# Altium project SGK_DVR_01.PrjPcb (part 2 of 2)

## Sheet P06 CPU_2.SchDoc
size 386 x 246 mm
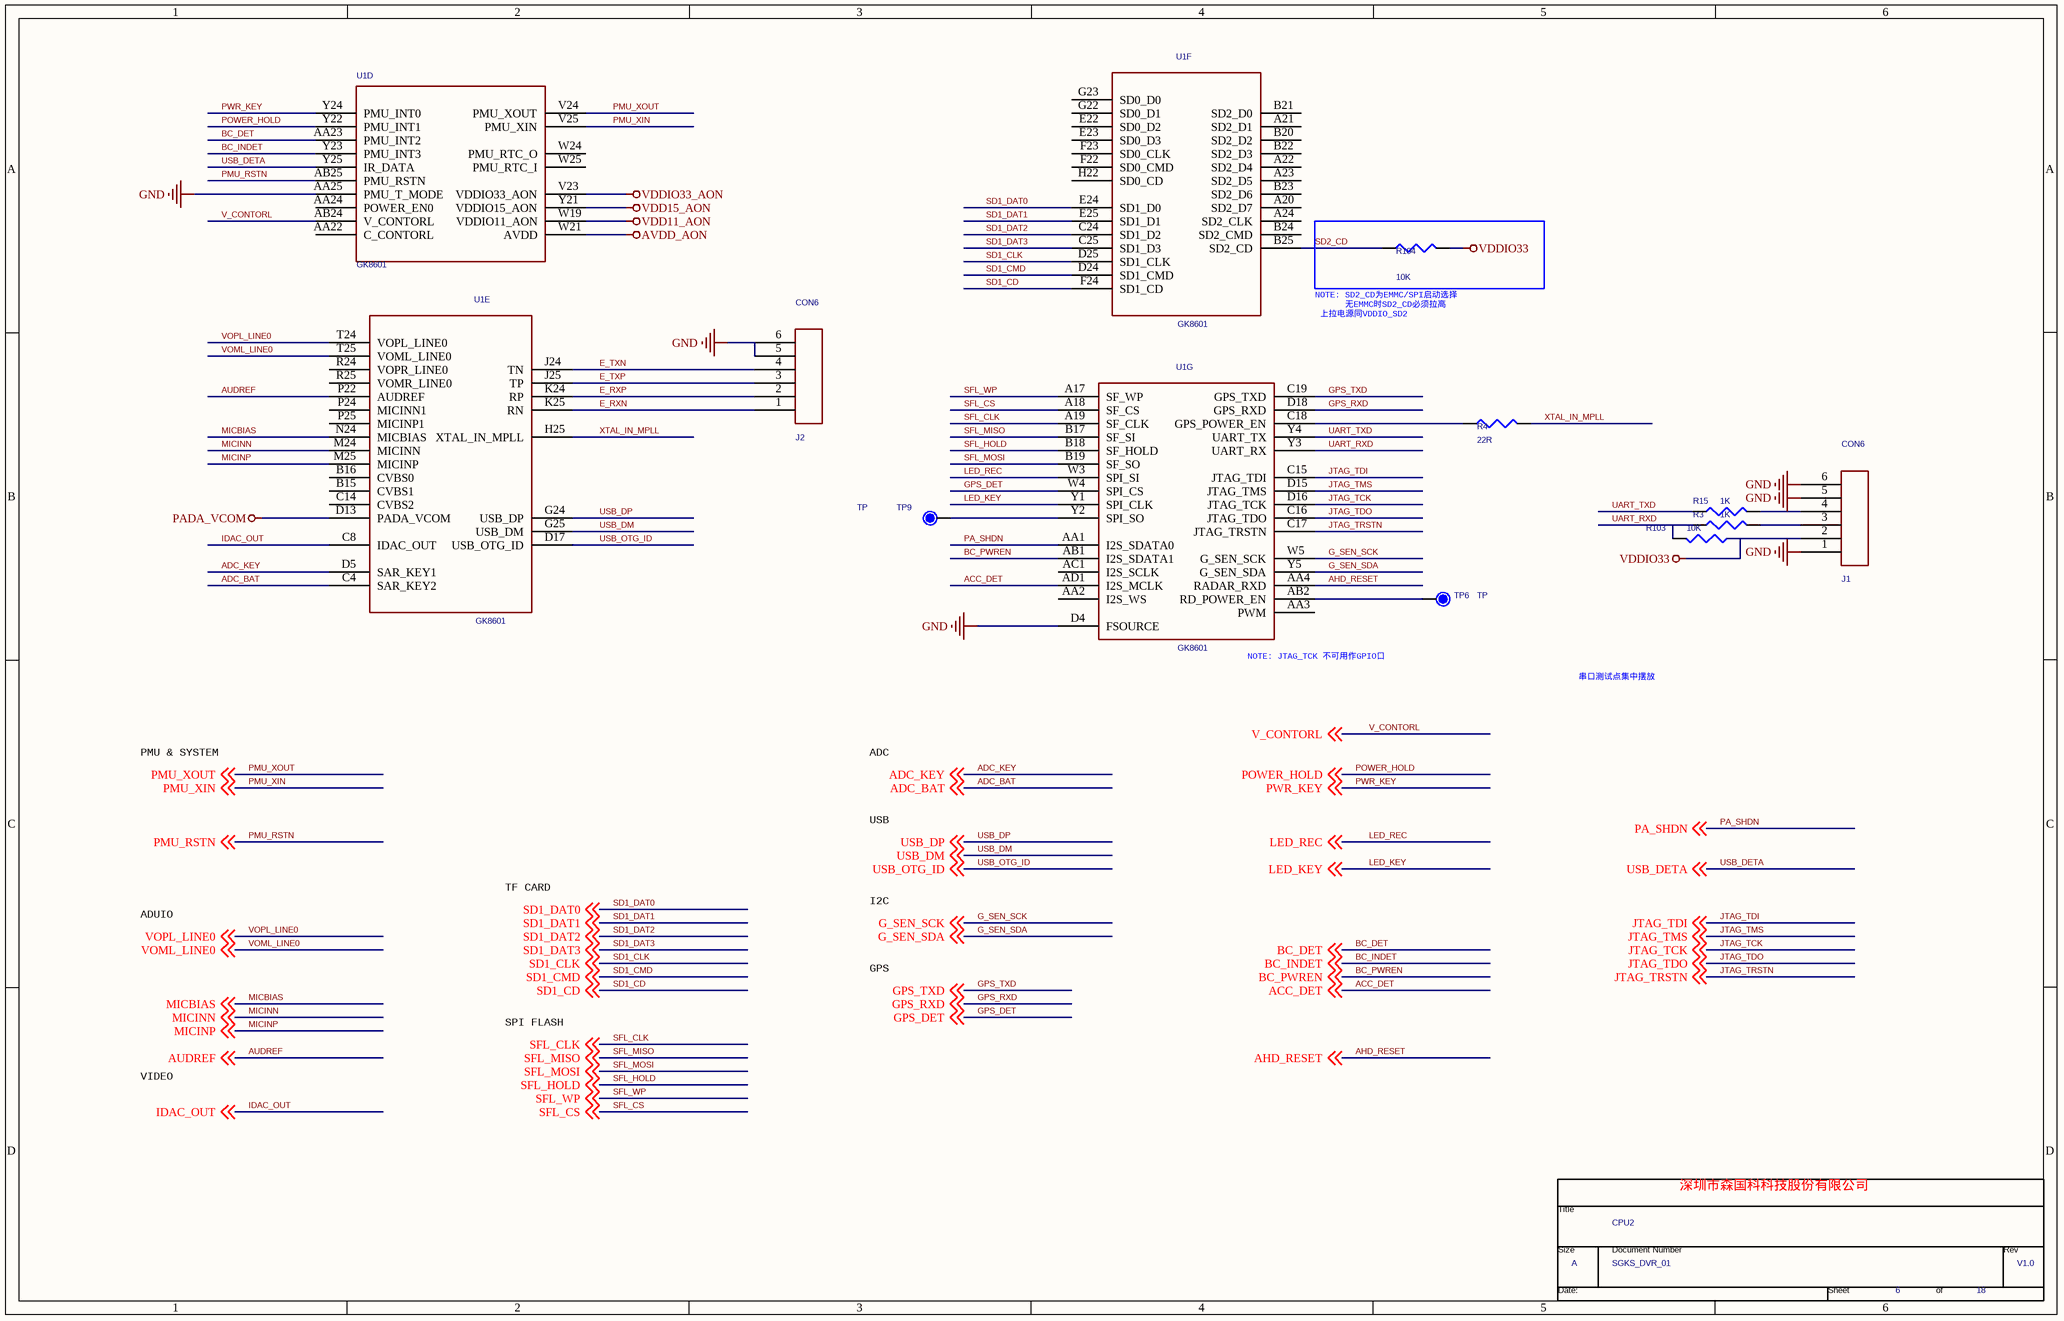
[diagram p11: P06 CPU_2.SchDoc]

### Parts
(Parts that share a designator on the sheet are numbered #1, #2 ... from top to bottom, then left to right.)
*#12  Page Count: 18  Page Number: 6  Page Size: A  Title: CPU2  RevCode: V1.0  Doc: SGKS_DVR_01  (hidden comment: TitleBlock0)  (graphical)
J1  CON6  [SM_125X4_180]
J2  CON6  [SM_125X4_180]
R3  1K  [R0603/SMD]
R4  22R  [R0603/SMD]
R15  1K  [R0603/SMD]
R103  10K  [R0402]
R104  10K  [R0603/SMD]
TP6  TP  [TP/SMD/D1.0]
TP9  TP  [TP/SMD/D1.0]
U1  GK8601  [FBGA-569-0.65-17X17]  (parts D,E,F,G of 12)

### Nets
AVDD_AON: J1.2 R103.1 R104.1 U1.V23(VDDIO33_AON) U1.W21(AVDD)  [also labelled VDDIO33, VDDIO33_AON]  [project net AVDD33]
GND: J1.1 J1.5 J1.6 J2.5 J2.6 U1.AA25(PMU_T_MODE) U1.D4(FSOURCE)
PADA_VCOM: U1.D13(PADA_VCOM)
VDD11_AON: U1.W19(VDDIO11_AON)  [project net VDD11]
VDD15_AON: U1.Y21(VDDIO15_AON)  [project net VDD15]
ACC_DET: U1.AD1(I2S_MCLK) ; off-sheet ACC_DET
ADC_BAT: U1.C4(SAR_KEY2) ; off-sheet ADC_BAT
ADC_KEY: U1.D5(SAR_KEY1) ; off-sheet ADC_KEY
AHD_RESET: U1.AA4(RADAR_RXD) ; off-sheet AHD_RESET
AUDREF: U1.P22(AUDREF) ; off-sheet AUDREF
BC_DET: U1.AA23(PMU_INT2) ; off-sheet BC_DET
BC_INDET: U1.Y23(PMU_INT3) ; off-sheet BC_INDET
BC_PWREN: U1.AB1(I2S_SDATA1) ; off-sheet BC_PWREN
E_RXN: J2.1 U1.K25(RN)
E_RXP: J2.2 U1.K24(RP)
E_TXN: J2.4 U1.J24(TN)
E_TXP: J2.3 U1.J25(TP)
G_SEN_SCK: U1.W5(G_SEN_SCK) ; off-sheet G_SEN_SCK
G_SEN_SDA: U1.Y5(G_SEN_SDA) ; off-sheet G_SEN_SDA
GPS_DET: U1.W4(SPI_CS) ; off-sheet GPS_DET
GPS_RXD: U1.D18(GPS_RXD) ; off-sheet GPS_RXD
GPS_TXD: U1.C19(GPS_TXD) ; off-sheet GPS_TXD
IDAC_OUT: U1.C8(IDAC_OUT) ; off-sheet IDAC_OUT
JTAG_TCK: U1.D16(JTAG_TCK) ; off-sheet JTAG_TCK
JTAG_TDI: U1.C15(JTAG_TDI) ; off-sheet JTAG_TDI
JTAG_TDO: U1.C16(JTAG_TDO) ; off-sheet JTAG_TDO
JTAG_TMS: U1.D15(JTAG_TMS) ; off-sheet JTAG_TMS
JTAG_TRSTN: U1.C17(JTAG_TRSTN) ; off-sheet JTAG_TRSTN
LED_KEY: U1.Y1(SPI_CLK) ; off-sheet LED_KEY
LED_REC: U1.W3(SPI_SI) ; off-sheet LED_REC
MICBIAS: U1.N24(MICBIAS) ; off-sheet MICBIAS
MICINN: U1.M24(MICINN) ; off-sheet MICINN
MICINP: U1.M25(MICINP) ; off-sheet MICINP
PA_SHDN: U1.AA1(I2S_SDATA0) ; off-sheet PA_SHDN
PMU_RSTN: U1.AB25(PMU_RSTN) ; off-sheet PMU_RSTN
PMU_XIN: U1.V25(PMU_XIN) ; off-sheet PMU_XIN
PMU_XOUT: U1.V24(PMU_XOUT) ; off-sheet PMU_XOUT
POWER_HOLD: U1.Y22(PMU_INT1) ; off-sheet POWER_HOLD
PWR_KEY: U1.Y24(PMU_INT0) ; off-sheet PWR_KEY
SD1_CD: U1.F24(SD1_CD) ; off-sheet SD1_CD
SD1_CLK: U1.D25(SD1_CLK) ; off-sheet SD1_CLK
SD1_CMD: U1.D24(SD1_CMD) ; off-sheet SD1_CMD
SD1_DAT0: U1.E24(SD1_D0) ; off-sheet SD1_DAT0
SD1_DAT1: U1.E25(SD1_D1) ; off-sheet SD1_DAT1
SD1_DAT2: U1.C24(SD1_D2) ; off-sheet SD1_DAT2
SD1_DAT3: U1.C25(SD1_D3) ; off-sheet SD1_DAT3
SD2_CD: R104.2 U1.B25(SD2_CD)
SFL_CLK: U1.A19(SF_CLK) ; off-sheet SFL_CLK
SFL_CS: U1.A18(SF_CS) ; off-sheet SFL_CS
SFL_HOLD: U1.B18(SF_HOLD) ; off-sheet SFL_HOLD
SFL_MISO: U1.B17(SF_SI) ; off-sheet SFL_MISO
SFL_MOSI: U1.B19(SF_SO) ; off-sheet SFL_MOSI
SFL_WP: U1.A17(SF_WP) ; off-sheet SFL_WP
UART_RXD: R3.1 R103.2 U1.Y3(UART_RX)
UART_TXD: R15.1 U1.Y4(UART_TX)
USB_DETA: U1.Y25(IR_DATA) ; off-sheet USB_DETA
USB_DM: U1.G25(USB_DM) ; off-sheet USB_DM
USB_DP: U1.G24(USB_DP) ; off-sheet USB_DP
USB_OTG_ID: U1.D17(USB_OTG_ID) ; off-sheet USB_OTG_ID
V_CONTORL: U1.AB24(V_CONTORL) ; off-sheet V_CONTORL
VOML_LINE0: U1.T25(VOML_LINE0) ; off-sheet VOML_LINE0
VOPL_LINE0: U1.T24(VOPL_LINE0) ; off-sheet VOPL_LINE0
XTAL_IN_MPLL: R4.2 U1.H25(XTAL_IN_MPLL)
NetJ1_3: J1.3 R3.2
NetJ1_4: J1.4 R15.2
NetR4_1: R4.1 U1.C18(GPS_POWER_EN)
NetTP6_1: TP6.1 U1.AB2(RD_POWER_EN)
NetTP9_1: TP9.1 U1.Y2(SPI_SO)

Not connected (* = marked no-connect by the designer): U1 A20(SD2_D7) A21(SD2_D1) A22(SD2_D4) A23(SD2_D5) A24(SD2_CLK) AA2(I2S_WS) AA3(PWM) AA22(C_CONTORL) AA24(POWER_EN0) AC1(I2S_SCLK) B15(CVBS1) B16(CVBS0) B20(SD2_D2) B21(SD2_D0) B22(SD2_D3) B23(SD2_D6) B24(SD2_CMD) C14(CVBS2) E22(SD0_D2) E23(SD0_D3) F22(SD0_CMD) F23(SD0_CLK) G22(SD0_D1) G23(SD0_D0) H22(SD0_CD) P24(MICINN1) P25(MICINP1) R24(VOPR_LINE0) R25(VOMR_LINE0) W24(PMU_RTC_O) W25(PMU_RTC_I)

### Notes on the sheet
- NOTE: SD2_CD为EMMC/SPI启动选择
  无EMMC时SD2_CD必须拉高
  上拉电源同VDDIO_SD2
- (near U1) NOTE: JTAG_TCK 不可用作GPIO口
- 串口测试点集中摆放
- PMU & SYSTEM
- ADC
- USB
- ADUIO
- TF CARD
- I2C
- GPS
- SPI FLASH
- VIDEO
- 深圳市森国科科技股份有限公司
- (in symbol TitleBlock0) Title; Size; Document Number; Rev; Date:; Sheet; of

### Library data of the parts
R3 R4 R15 R104 = RES/SMD_0: Part Description: Chip Resistor; Type: 贴片电阻
R103 = RESISTOR_Dup1: RES - 200 ohm 0603 1/16W 1%; Num Pins: 2; Page: 5
TP6 TP9 = TP_0: Part Description: Test Point; Type: NC
U1 = GK8601_12
*#12 = TitleBlock0: Page Create Date: March  8, 1995

## Sheet P05 CPU_1.SchDoc
size 386 x 246 mm
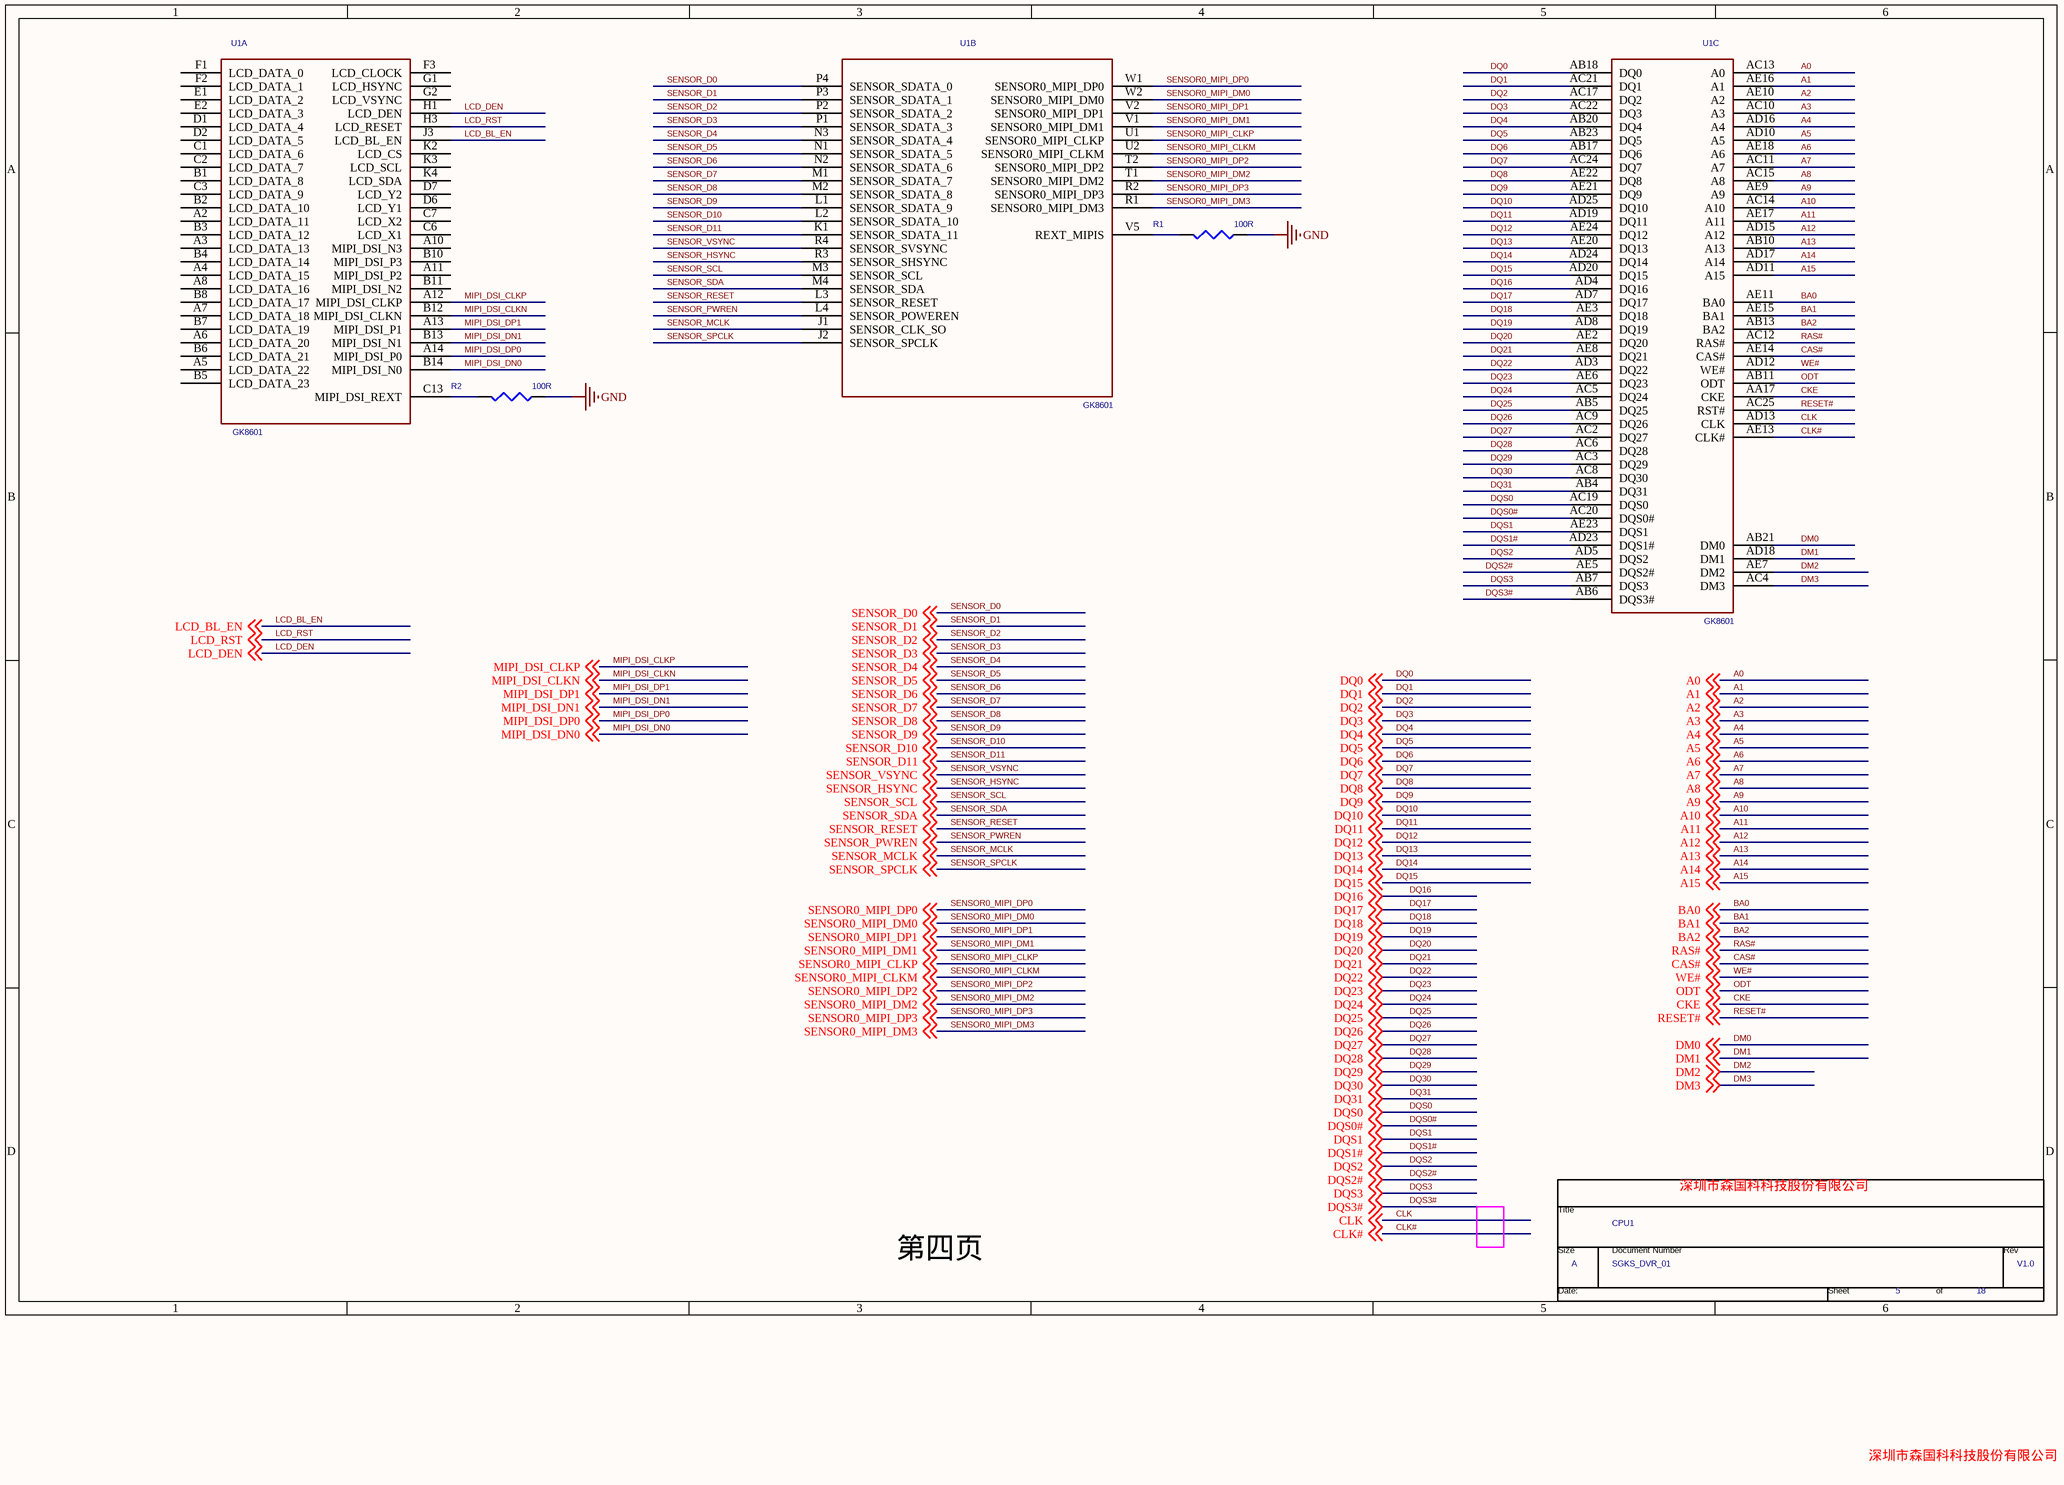
[diagram p12: P05 CPU_1.SchDoc]

### Parts
(Parts that share a designator on the sheet are numbered #1, #2 ... from top to bottom, then left to right.)
*#13  Page Count: 18  Page Number: 5  Page Size: A  Title: CPU1  RevCode: V1.0  Doc: SGKS_DVR_01  (hidden comment: TitleBlock0)  (graphical)
R1  100R  [R0402]
R2  100R  [R0402]
U1  GK8601  [FBGA-569-0.65-17X17]  (parts A,B,C of 12)

### Nets
GND: R1.2 R2.2
A0: U1.AC13(A0) ; off-sheet A0
A1: U1.AE16(A1) ; off-sheet A1
A2: U1.AE10(A2) ; off-sheet A2
A3: U1.AC10(A3) ; off-sheet A3
A4: U1.AD16(A4) ; off-sheet A4
A5: U1.AD10(A5) ; off-sheet A5
A6: U1.AE18(A6) ; off-sheet A6
A7: U1.AC11(A7) ; off-sheet A7
A8: U1.AC15(A8) ; off-sheet A8
A9: U1.AE9(A9) ; off-sheet A9
A10: U1.AC14(A10) ; off-sheet A10
A11: U1.AE17(A11) ; off-sheet A11
A12: U1.AD15(A12) ; off-sheet A12
A13: U1.AB10(A13) ; off-sheet A13
A14: U1.AD17(A14) ; off-sheet A14
A15: U1.AD11(A15) ; off-sheet A15
BA0: U1.AE11(BA0) ; off-sheet BA0
BA1: U1.AE15(BA1) ; off-sheet BA1
BA2: U1.AB13(BA2) ; off-sheet BA2
CAS#: U1.AE14(CAS#) ; off-sheet CAS#
CKE: U1.AA17(CKE) ; off-sheet CKE
CLK: U1.AD13(CLK) ; off-sheet CLK
CLK#: U1.AE13(CLK#) ; off-sheet CLK#
DM0: U1.AB21(DM0) ; off-sheet DM0
DM1: U1.AD18(DM1) ; off-sheet DM1
DM2: U1.AE7(DM2) ; off-sheet DM2
DM3: U1.AC4(DM3) ; off-sheet DM3
DQ0: U1.AB18(DQ0) ; off-sheet DQ0
DQ1: U1.AC21(DQ1) ; off-sheet DQ1
DQ2: U1.AC17(DQ2) ; off-sheet DQ2
DQ3: U1.AC22(DQ3) ; off-sheet DQ3
DQ4: U1.AB20(DQ4) ; off-sheet DQ4
DQ5: U1.AB23(DQ5) ; off-sheet DQ5
DQ6: U1.AB17(DQ6) ; off-sheet DQ6
DQ7: U1.AC24(DQ7) ; off-sheet DQ7
DQ8: U1.AE22(DQ8) ; off-sheet DQ8
DQ9: U1.AE21(DQ9) ; off-sheet DQ9
DQ10: U1.AD25(DQ10) ; off-sheet DQ10
DQ11: U1.AD19(DQ11) ; off-sheet DQ11
DQ12: U1.AE24(DQ12) ; off-sheet DQ12
DQ13: U1.AE20(DQ13) ; off-sheet DQ13
DQ14: U1.AD24(DQ14) ; off-sheet DQ14
DQ15: U1.AD20(DQ15) ; off-sheet DQ15
DQ16: U1.AD4(DQ16) ; off-sheet DQ16
DQ17: U1.AD7(DQ17) ; off-sheet DQ17
DQ18: U1.AE3(DQ18) ; off-sheet DQ18
DQ19: U1.AD8(DQ19) ; off-sheet DQ19
DQ20: U1.AE2(DQ20) ; off-sheet DQ20
DQ21: U1.AE8(DQ21) ; off-sheet DQ21
DQ22: U1.AD3(DQ22) ; off-sheet DQ22
DQ23: U1.AE6(DQ23) ; off-sheet DQ23
DQ24: U1.AC5(DQ24) ; off-sheet DQ24
DQ25: U1.AB5(DQ25) ; off-sheet DQ25
DQ26: U1.AC9(DQ26) ; off-sheet DQ26
DQ27: U1.AC2(DQ27) ; off-sheet DQ27
DQ28: U1.AC6(DQ28) ; off-sheet DQ28
DQ29: U1.AC3(DQ29) ; off-sheet DQ29
DQ30: U1.AC8(DQ30) ; off-sheet DQ30
DQ31: U1.AB4(DQ31) ; off-sheet DQ31
DQS0: U1.AC19(DQS0) ; off-sheet DQS0
DQS0#: U1.AC20(DQS0#) ; off-sheet DQS0#
DQS1: U1.AE23(DQS1) ; off-sheet DQS1
DQS1#: U1.AD23(DQS1#) ; off-sheet DQS1#
DQS2: U1.AD5(DQS2) ; off-sheet DQS2
DQS2#: U1.AE5(DQS2#) ; off-sheet DQS2#
DQS3: U1.AB7(DQS3) ; off-sheet DQS3
DQS3#: U1.AB6(DQS3#) ; off-sheet DQS3#
LCD_BL_EN: U1.J3(LCD_BL_EN) ; off-sheet LCD_BL_EN
LCD_DEN: U1.H1(LCD_DEN) ; off-sheet LCD_DEN
LCD_RST: U1.H3(LCD_RESET) ; off-sheet LCD_RST
MIPI_DSI_CLKN: U1.B12(MIPI_DSI_CLKN) ; off-sheet MIPI_DSI_CLKN
MIPI_DSI_CLKP: U1.A12(MIPI_DSI_CLKP) ; off-sheet MIPI_DSI_CLKP
MIPI_DSI_DN0: U1.B14(MIPI_DSI_N0) ; off-sheet MIPI_DSI_DN0
MIPI_DSI_DN1: U1.B13(MIPI_DSI_N1) ; off-sheet MIPI_DSI_DN1
MIPI_DSI_DP0: U1.A14(MIPI_DSI_P0) ; off-sheet MIPI_DSI_DP0
MIPI_DSI_DP1: U1.A13(MIPI_DSI_P1) ; off-sheet MIPI_DSI_DP1
ODT: U1.AB11(ODT) ; off-sheet ODT
RAS#: U1.AC12(RAS#) ; off-sheet RAS#
RESET#: U1.AC25(RST#) ; off-sheet RESET#
SENSOR0_MIPI_CLKM: U1.U2(SENSOR0_MIPI_CLKM) ; off-sheet SENSOR0_MIPI_CLKM
SENSOR0_MIPI_CLKP: U1.U1(SENSOR0_MIPI_CLKP) ; off-sheet SENSOR0_MIPI_CLKP
SENSOR0_MIPI_DM0: U1.W2(SENSOR0_MIPI_DM0) ; off-sheet SENSOR0_MIPI_DM0
SENSOR0_MIPI_DM1: U1.V1(SENSOR0_MIPI_DM1) ; off-sheet SENSOR0_MIPI_DM1
SENSOR0_MIPI_DM2: U1.T1(SENSOR0_MIPI_DM2) ; off-sheet SENSOR0_MIPI_DM2
SENSOR0_MIPI_DM3: U1.R1(SENSOR0_MIPI_DM3) ; off-sheet SENSOR0_MIPI_DM3
SENSOR0_MIPI_DP0: U1.W1(SENSOR0_MIPI_DP0) ; off-sheet SENSOR0_MIPI_DP0
SENSOR0_MIPI_DP1: U1.V2(SENSOR0_MIPI_DP1) ; off-sheet SENSOR0_MIPI_DP1
SENSOR0_MIPI_DP2: U1.T2(SENSOR0_MIPI_DP2) ; off-sheet SENSOR0_MIPI_DP2
SENSOR0_MIPI_DP3: U1.R2(SENSOR0_MIPI_DP3) ; off-sheet SENSOR0_MIPI_DP3
SENSOR_D0: U1.P4(SENSOR_SDATA_0) ; off-sheet SENSOR_D0
SENSOR_D1: U1.P3(SENSOR_SDATA_1) ; off-sheet SENSOR_D1
SENSOR_D2: U1.P2(SENSOR_SDATA_2) ; off-sheet SENSOR_D2
SENSOR_D3: U1.P1(SENSOR_SDATA_3) ; off-sheet SENSOR_D3
SENSOR_D4: U1.N3(SENSOR_SDATA_4) ; off-sheet SENSOR_D4
SENSOR_D5: U1.N1(SENSOR_SDATA_5) ; off-sheet SENSOR_D5
SENSOR_D6: U1.N2(SENSOR_SDATA_6) ; off-sheet SENSOR_D6
SENSOR_D7: U1.M1(SENSOR_SDATA_7) ; off-sheet SENSOR_D7
SENSOR_D8: U1.M2(SENSOR_SDATA_8) ; off-sheet SENSOR_D8
SENSOR_D9: U1.L1(SENSOR_SDATA_9) ; off-sheet SENSOR_D9
SENSOR_D10: U1.L2(SENSOR_SDATA_10) ; off-sheet SENSOR_D10
SENSOR_D11: U1.K1(SENSOR_SDATA_11) ; off-sheet SENSOR_D11
SENSOR_HSYNC: U1.R3(SENSOR_SHSYNC) ; off-sheet SENSOR_HSYNC
SENSOR_MCLK: U1.J1(SENSOR_CLK_SO) ; off-sheet SENSOR_MCLK
SENSOR_PWREN: U1.L4(SENSOR_POWEREN) ; off-sheet SENSOR_PWREN
SENSOR_RESET: U1.L3(SENSOR_RESET) ; off-sheet SENSOR_RESET
SENSOR_SCL: U1.M3(SENSOR_SCL) ; off-sheet SENSOR_SCL
SENSOR_SDA: U1.M4(SENSOR_SDA) ; off-sheet SENSOR_SDA
SENSOR_SPCLK: U1.J2(SENSOR_SPCLK) ; off-sheet SENSOR_SPCLK
SENSOR_VSYNC: U1.R4(SENSOR_SVSYNC) ; off-sheet SENSOR_VSYNC
WE#: U1.AD12(WE#) ; off-sheet WE#
NetR1_1: R1.1 U1.V5(REXT_MIPIS)
NetR2_1: R2.1 U1.C13(MIPI_DSI_REXT)

Not connected (* = marked no-connect by the designer): U1 A2(LCD_DATA_11) A3(LCD_DATA_13) A4(LCD_DATA_15) A5(LCD_DATA_22) A6(LCD_DATA_20) A7(LCD_DATA_18) A8(LCD_DATA_16) A10(MIPI_DSI_N3) A11(MIPI_DSI_P2) B1(LCD_DATA_8) B2(LCD_DATA_10) B3(LCD_DATA_12) B4(LCD_DATA_14) B5(LCD_DATA_23) B6(LCD_DATA_21) B7(LCD_DATA_19) B8(LCD_DATA_17) B10(MIPI_DSI_P3) B11(MIPI_DSI_N2) C1(LCD_DATA_6) C2(LCD_DATA_7) C3(LCD_DATA_9) C6(LCD_X1) C7(LCD_X2) D1(LCD_DATA_4) D2(LCD_DATA_5) D6(LCD_Y1) D7(LCD_Y2) E1(LCD_DATA_2) E2(LCD_DATA_3) F1(LCD_DATA_0) F2(LCD_DATA_1) F3(LCD_CLOCK) G1(LCD_HSYNC) G2(LCD_VSYNC) K2(LCD_CS) K3(LCD_SCL) K4(LCD_SDA)

### Notes on the sheet
- 深圳市森国科科技股份有限公司
- 第四页
- (in symbol TitleBlock0) Title; Size; Document Number; Rev; Date:; Sheet; of

### Library data of the parts
R1 R2 = RESISTOR_Dup2
U1 = GK8601_12
*#13 = TitleBlock0: Page Create Date: March  8, 1995

## Sheet P04 Pin MAP.SchDoc
size 420 x 297 mm
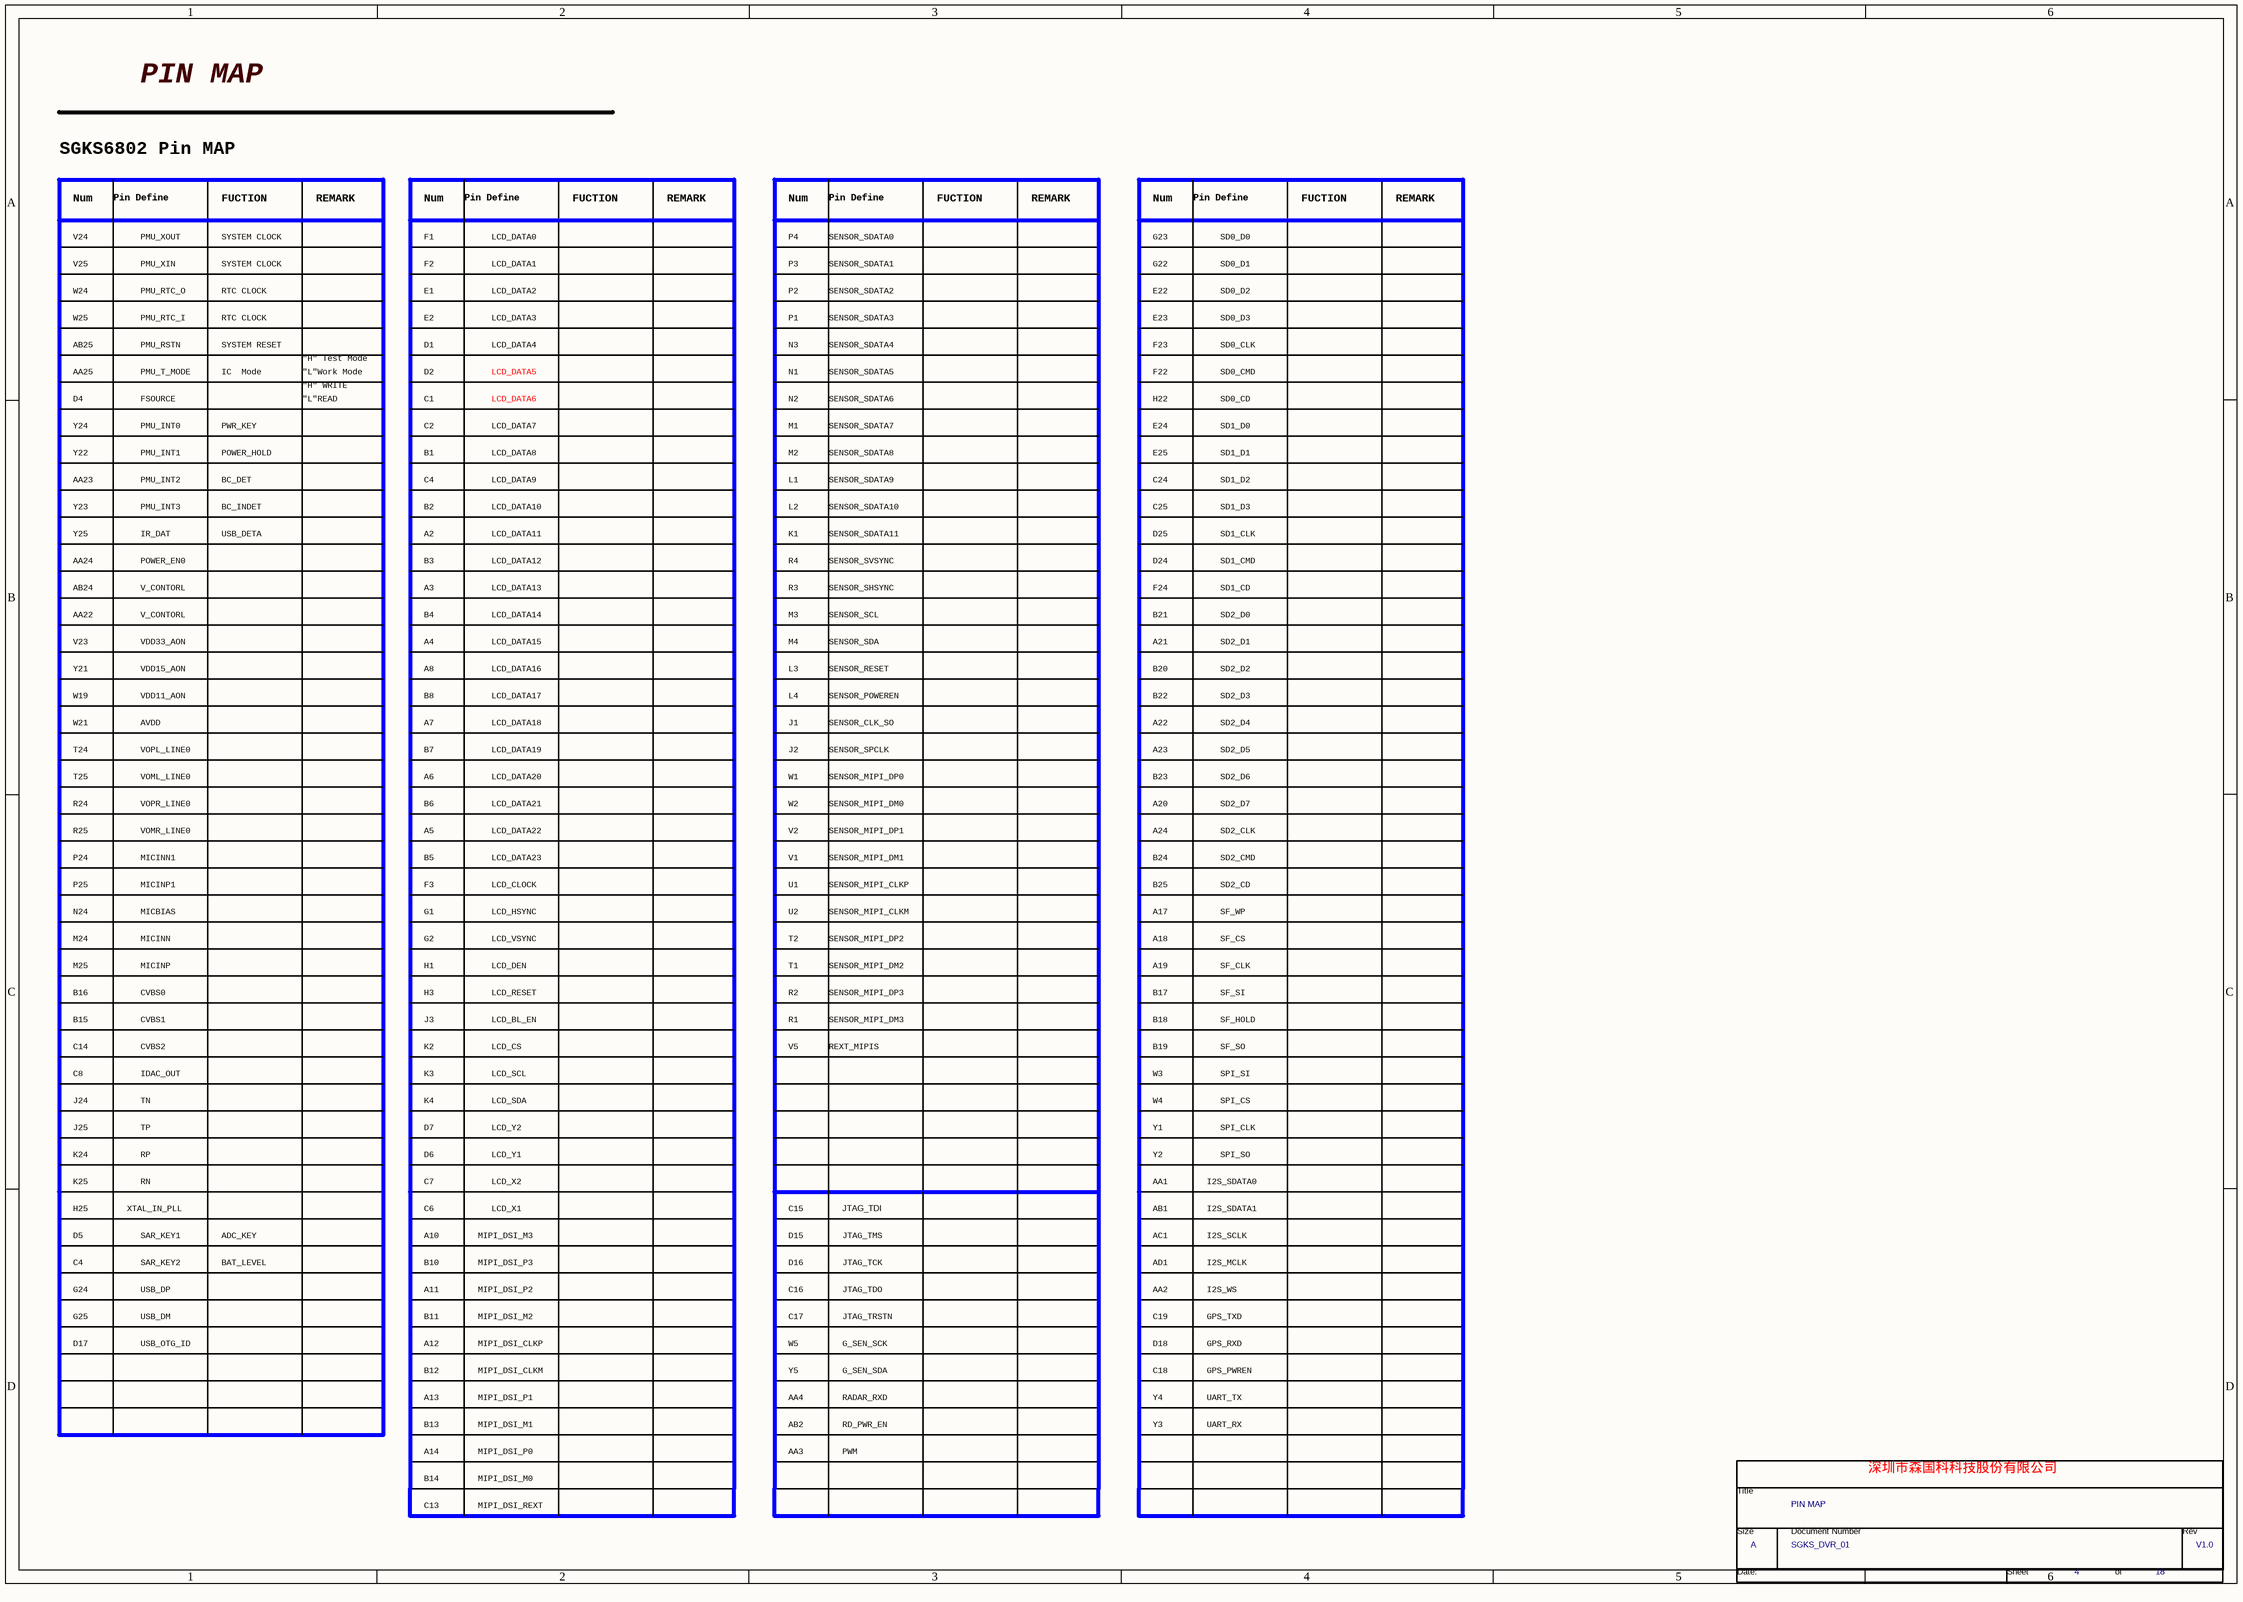
[diagram p13: P04 Pin MAP.SchDoc]

### Parts
(Parts that share a designator on the sheet are numbered #1, #2 ... from top to bottom, then left to right.)
*#14  Page Count: 18  Page Number: 4  Page Size: A  Title: PIN MAP  RevCode: V1.0  Doc: SGKS_DVR_01  (hidden comment: TitleBlock0)  (graphical)

### Notes on the sheet
- PIN MAP
- SGKS6802 Pin MAP
- Num
- V24
- Pin Define
- PMU_XOUT
- SYSTEM CLOCK
- FUCTION
- REMARK
- F1
- LCD_DATA0
- P4
- SENSOR_SDATA0
- G23
- SD0_D0
- V25
- W24
- W25
- PMU_RTC_I
- PMU_RTC_O
- PMU_XIN
- RTC CLOCK
- F2
- E1
- E2
- LCD_DATA3
- LCD_DATA2
- LCD_DATA1
- P3
- P2
- P1
- SENSOR_SDATA1
- SENSOR_SDATA2
- SENSOR_SDATA3
- G22
- E22
- E23
- SD0_D3
- SD0_D2
- SD0_D1
- AB25
- AA25
- PMU_T_MODE
- PMU_RSTN
- IC  Mode
- SYSTEM RESET
- "H" Test Mode
- "L"Work Mode
- "H" WRITE
- D1
- D2
- LCD_DATA4
- LCD_DATA5
- N3
- N1
- SENSOR_SDATA4
- SENSOR_SDATA5
- F23
- F22
- SD0_CLK
- SD0_CMD
- D4
- Y24
- Y22
- PMU_INT1
- FSOURCE
- PMU_INT0
- PWR_KEY
- POWER_HOLD
- "L"READ
- C1
- C2
- B1
- LCD_DATA8
- LCD_DATA7
- LCD_DATA6
- N2
- M1
- M2
- SENSOR_SDATA6
- SENSOR_SDATA7
- SENSOR_SDATA8
- H22
- E24
- E25
- SD1_D1
- SD1_D0
- SD0_CD
- AA23
- Y23
- PMU_INT3
- PMU_INT2
- BC_DET
- BC_INDET
- C4
- B2
- LCD_DATA9
- LCD_DATA10
- L1
- L2
- SENSOR_SDATA9
- SENSOR_SDATA10
- C24
- C25
- SD1_D2
- SD1_D3
- Y25
- AA24
- AB24
- POWER_EN0
- IR_DAT
- V_CONTORL
- USB_DETA
- A2
- B3
- A3
- LCD_DATA11
- LCD_DATA12
- LCD_DATA13
- K1
- R4
- R3
- SENSOR_SDATA11
- SENSOR_SVSYNC
- SENSOR_SHSYNC
- D25
- D24
- F24
- SD1_CLK
- SD1_CMD
- SD1_CD
- AA22
- V23
- VDD33_AON
- B4
- A4
- LCD_DATA15
- LCD_DATA14
- M3
- M4
- SENSOR_SCL
- SENSOR_SDA
- B21
- A21
- SD2_D1
- SD2_D0
- Y21
- W19
- W21
- AVDD
- VDD15_AON
- VDD11_AON
- A8
- B8
- A7
- LCD_DATA16
- LCD_DATA17
- LCD_DATA18
- L3
- L4
- J1
- SENSOR_CLK_SO
- SENSOR_POWEREN
- SENSOR_RESET
- B20
- B22
- A22
- SD2_D2
- SD2_D3
- SD2_D4
- T24
- T25
- VOML_LINE0
- VOPL_LINE0
- B7
- A6
- LCD_DATA19
- LCD_DATA20
- J2
- W1
- SENSOR_MIPI_DP0
- SENSOR_SPCLK
- A23
- B23
- SD2_D5
- SD2_D6
- R24
- R25
- P24
- VOMR_LINE0
- VOPR_LINE0
- MICINN1
- B6
- A5
- B5
- LCD_DATA21
- LCD_DATA22
- LCD_DATA23
- W2
- V2
- V1
- SENSOR_MIPI_DP1
- SENSOR_MIPI_DM1
- SENSOR_MIPI_DM0
- A20
- A24
- B24
- SD2_D7
- SD2_CLK
- SD2_CMD
- P25
- N24
- MICINP1
- MICBIAS
- F3
- G1
- LCD_HSYNC
- LCD_CLOCK
- U1
- U2
- SENSOR_MIPI_CLKP
- SENSOR_MIPI_CLKM
- B25
- A17
- SF_WP
- SD2_CD
- M24
- M25
- B16
- MICINN
- MICINP
- CVBS0
- G2
- H1
- H3
- LCD_VSYNC
- LCD_DEN
- LCD_RESET
- T2
- T1
- R2
- SENSOR_MIPI_DP2
- SENSOR_MIPI_DM2
- SENSOR_MIPI_DP3
- A18
- A19
- B17
- SF_CS
- SF_CLK
- SF_SI
- B15
- C14
- CVBS1
- CVBS2
- J3
- K2
- LCD_BL_EN
- LCD_CS
- R1
- V5
- SENSOR_MIPI_DM3
- REXT_MIPIS
- B18
- B19
- SF_HOLD
- SF_SO
- C8
- J24
- J25
- IDAC_OUT
- TN
- TP
- K3
- K4
- D7
- LCD_SCL
- LCD_SDA
- LCD_Y2
- W3
- W4
- Y1
- SPI_SI
- SPI_CS
- SPI_CLK
- K24
- K25
- RP
- RN
- D6
- C7
- LCD_Y1
- LCD_X2
- Y2
- AA1
- I2S_SDATA0
- SPI_SO
- H25
- D5
- XTAL_IN_PLL
- SAR_KEY1
- SAR_KEY2
- ADC_KEY
- BAT_LEVEL
- A10
- B10
- C6
- MIPI_DSI_M3
- MIPI_DSI_P3
- LCD_X1
- D15
- D16
- C15
- JTAG_TMS
- JTAG_TCK
- JTAG_TDI
- AC1
- AD1
- AB1
- I2S_SCLK
- I2S_MCLK
- I2S_SDATA1
- G24
- G25
- USB_DP
- USB_DM
- A11
- B11
- MIPI_DSI_P2
- MIPI_DSI_M2
- C16
- C17
- JTAG_TDO
- JTAG_TRSTN
- AA2
- C19
- I2S_WS
- GPS_TXD
- D17
- USB_OTG_ID
- A12
- B12
- A13
- MIPI_DSI_CLKP
- MIPI_DSI_CLKM
- MIPI_DSI_P1
- W5
- Y5
- AA4
- G_SEN_SCK
- G_SEN_SDA
- RADAR_RXD
- D18
- C18
- Y4
- GPS_RXD
- GPS_PWREN
- UART_TX
- B13
- A14
- MIPI_DSI_M1
- MIPI_DSI_P0
- AB2
- AA3
- RD_PWR_EN
- PWM
- Y3
- UART_RX
- 深圳市森国科科技股份有限公司
- B14
- C13
- MIPI_DSI_M0
- MIPI_DSI_REXT
- (in symbol TitleBlock0) Title; Size; Document Number; Rev; Date:; Sheet; of

### Library data of the parts
*#14 = TitleBlock0: Page Create Date: March  8, 1995

## Sheet P03 POWER TREE.SchDoc
size 420 x 297 mm
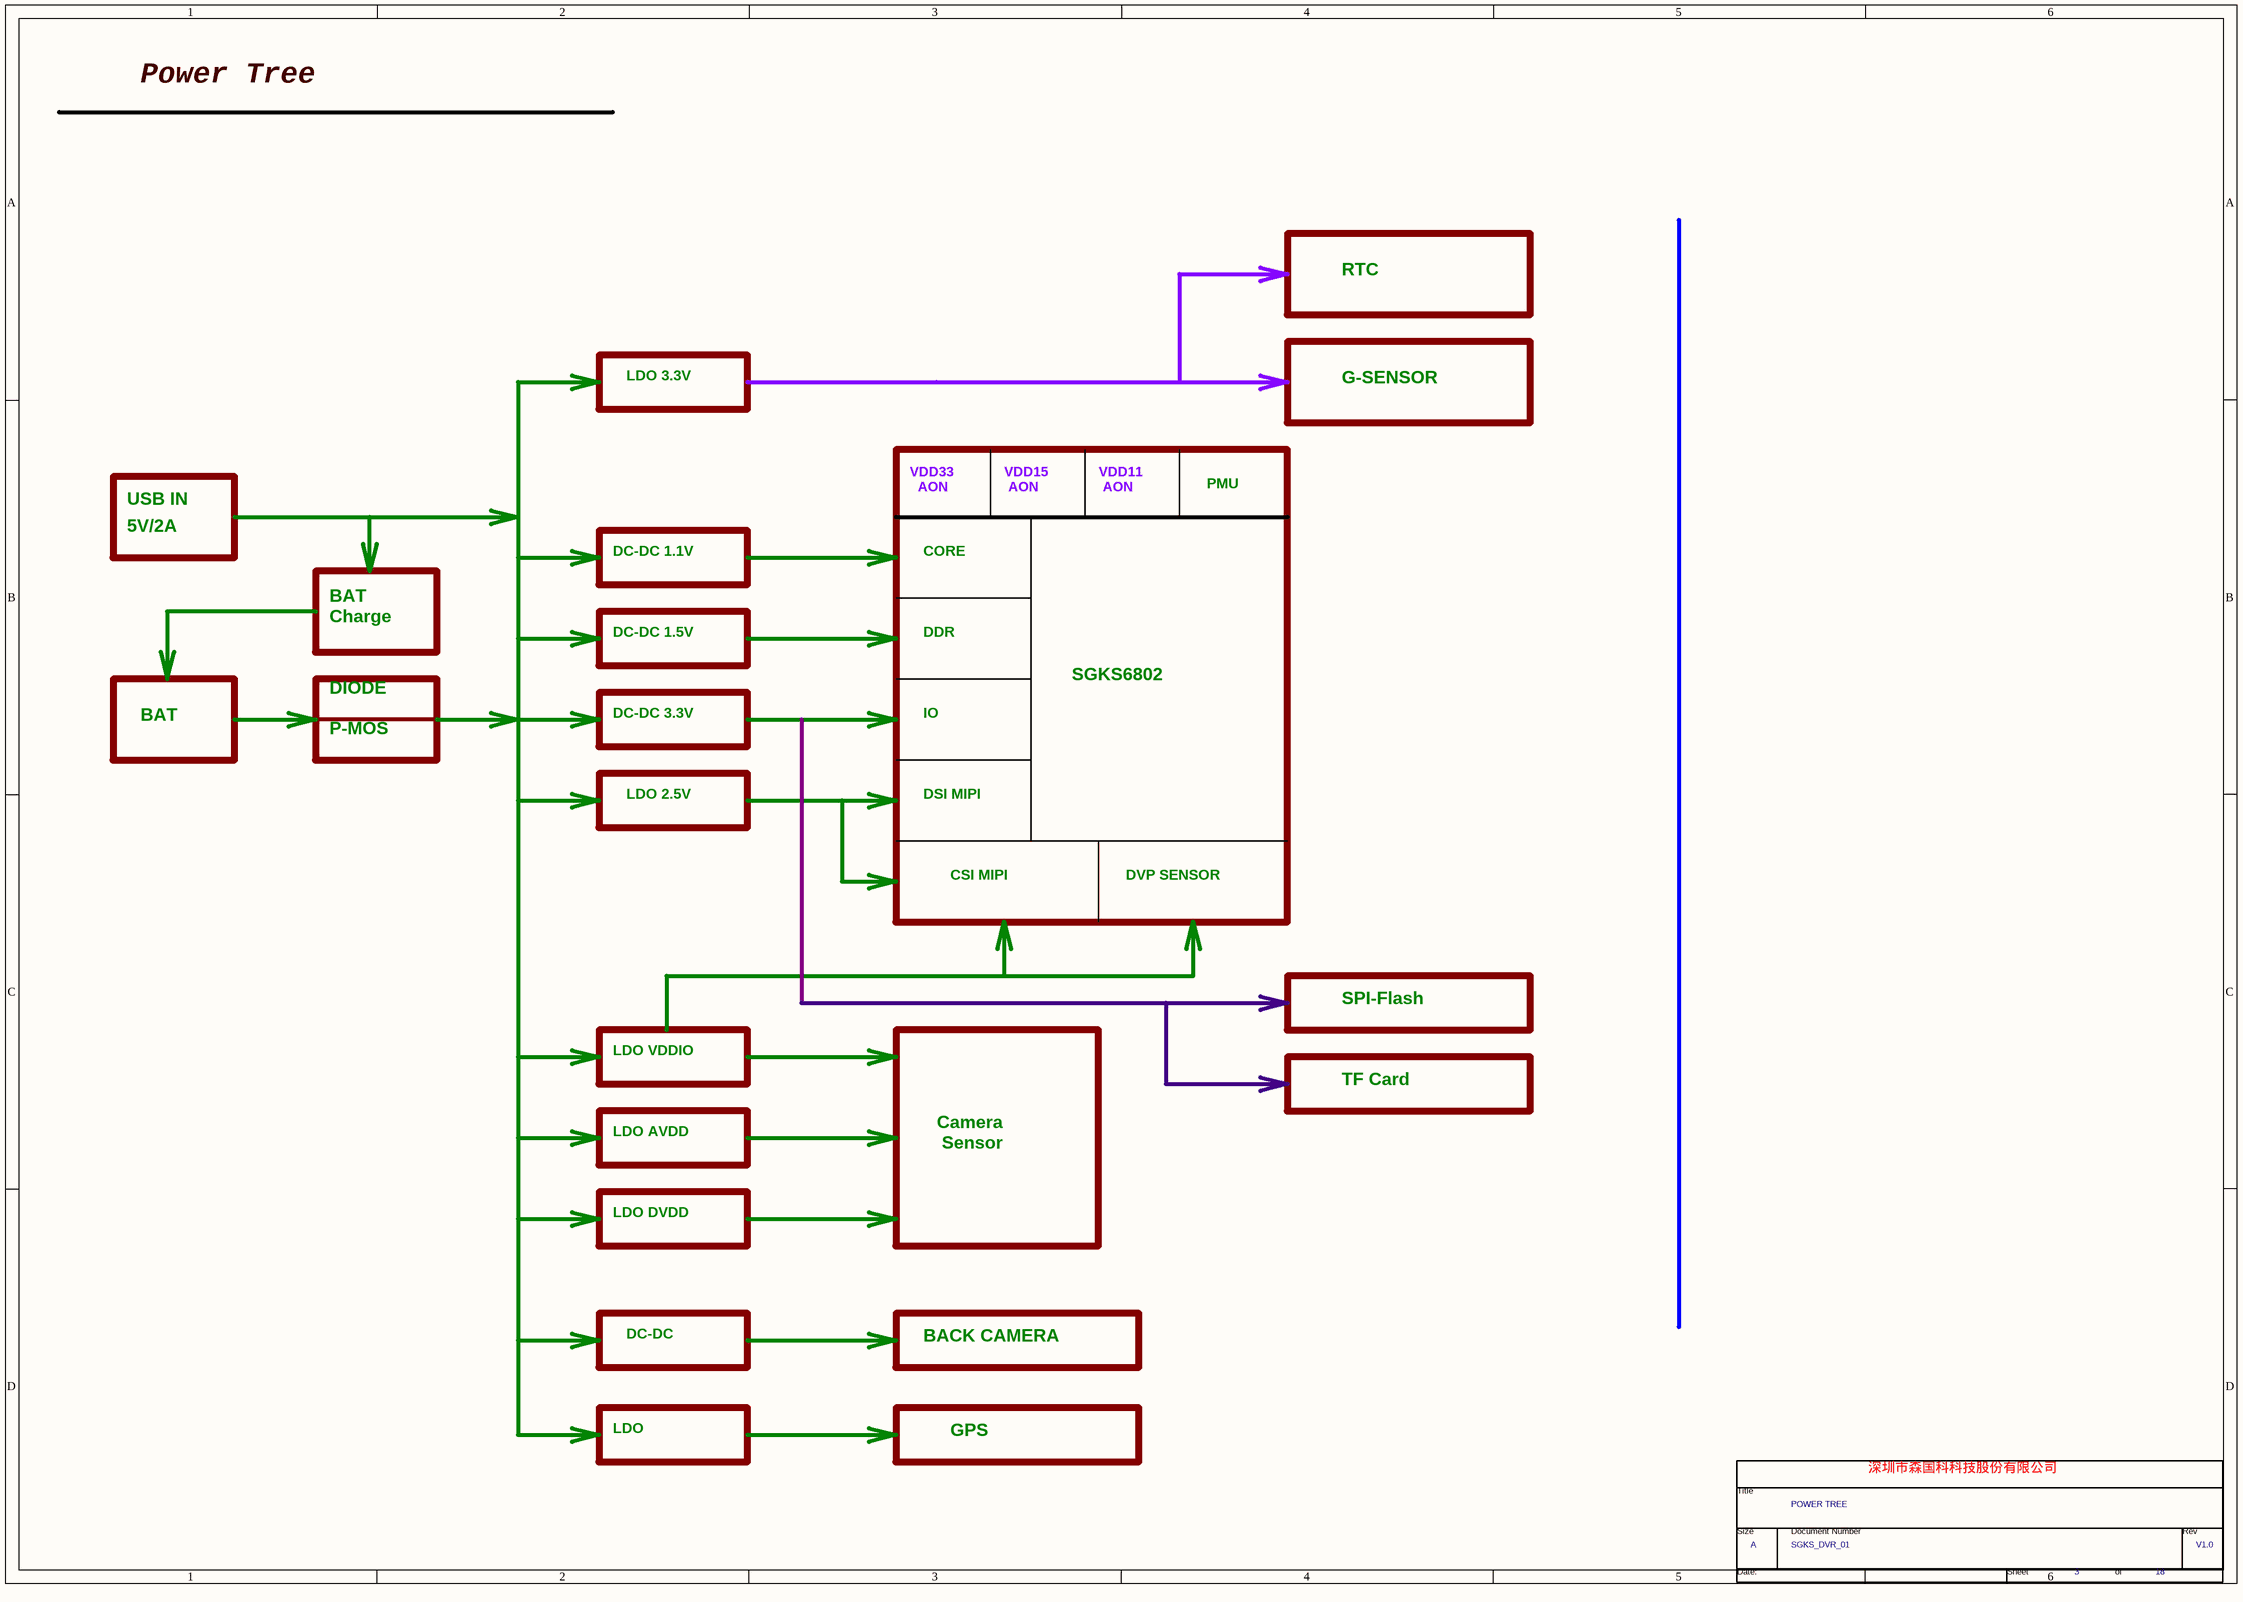
[diagram p14: P03 POWER TREE.SchDoc]

### Parts
(Parts that share a designator on the sheet are numbered #1, #2 ... from top to bottom, then left to right.)
*#15  Page Count: 18  Page Number: 3  Page Size: A  Title: POWER TREE  RevCode: V1.0  Doc: SGKS_DVR_01  (hidden comment: TitleBlock0)  (graphical)

### Notes on the sheet
- Power Tree
- RTC
- LDO 3.3V
- G-SENSOR
- VDD33
  AON
- VDD15
  AON
- VDD11
  AON
- USB IN
- 5V/2A
- PMU
- BAT
  Charge
- DC-DC 1.1V
- CORE
- DC-DC 1.5V
- DDR
- BAT
- DIODE
- DC-DC 3.3V
- IO
- SGKS6802
- P-MOS
- LDO 2.5V
- DSI MIPI
- CSI MIPI
- DVP SENSOR
- LDO VDDIO
- SPI-Flash
- LDO AVDD
- Camera
  Sensor
- TF Card
- LDO DVDD
- DC-DC
- BACK CAMERA
- LDO
- GPS
- 深圳市森国科科技股份有限公司
- (in symbol TitleBlock0) Title; Size; Document Number; Rev; Date:; Sheet; of

### Library data of the parts
*#15 = TitleBlock0: Page Create Date: March  8, 1995

## Sheet P02 Block.SchDoc
size 420 x 297 mm
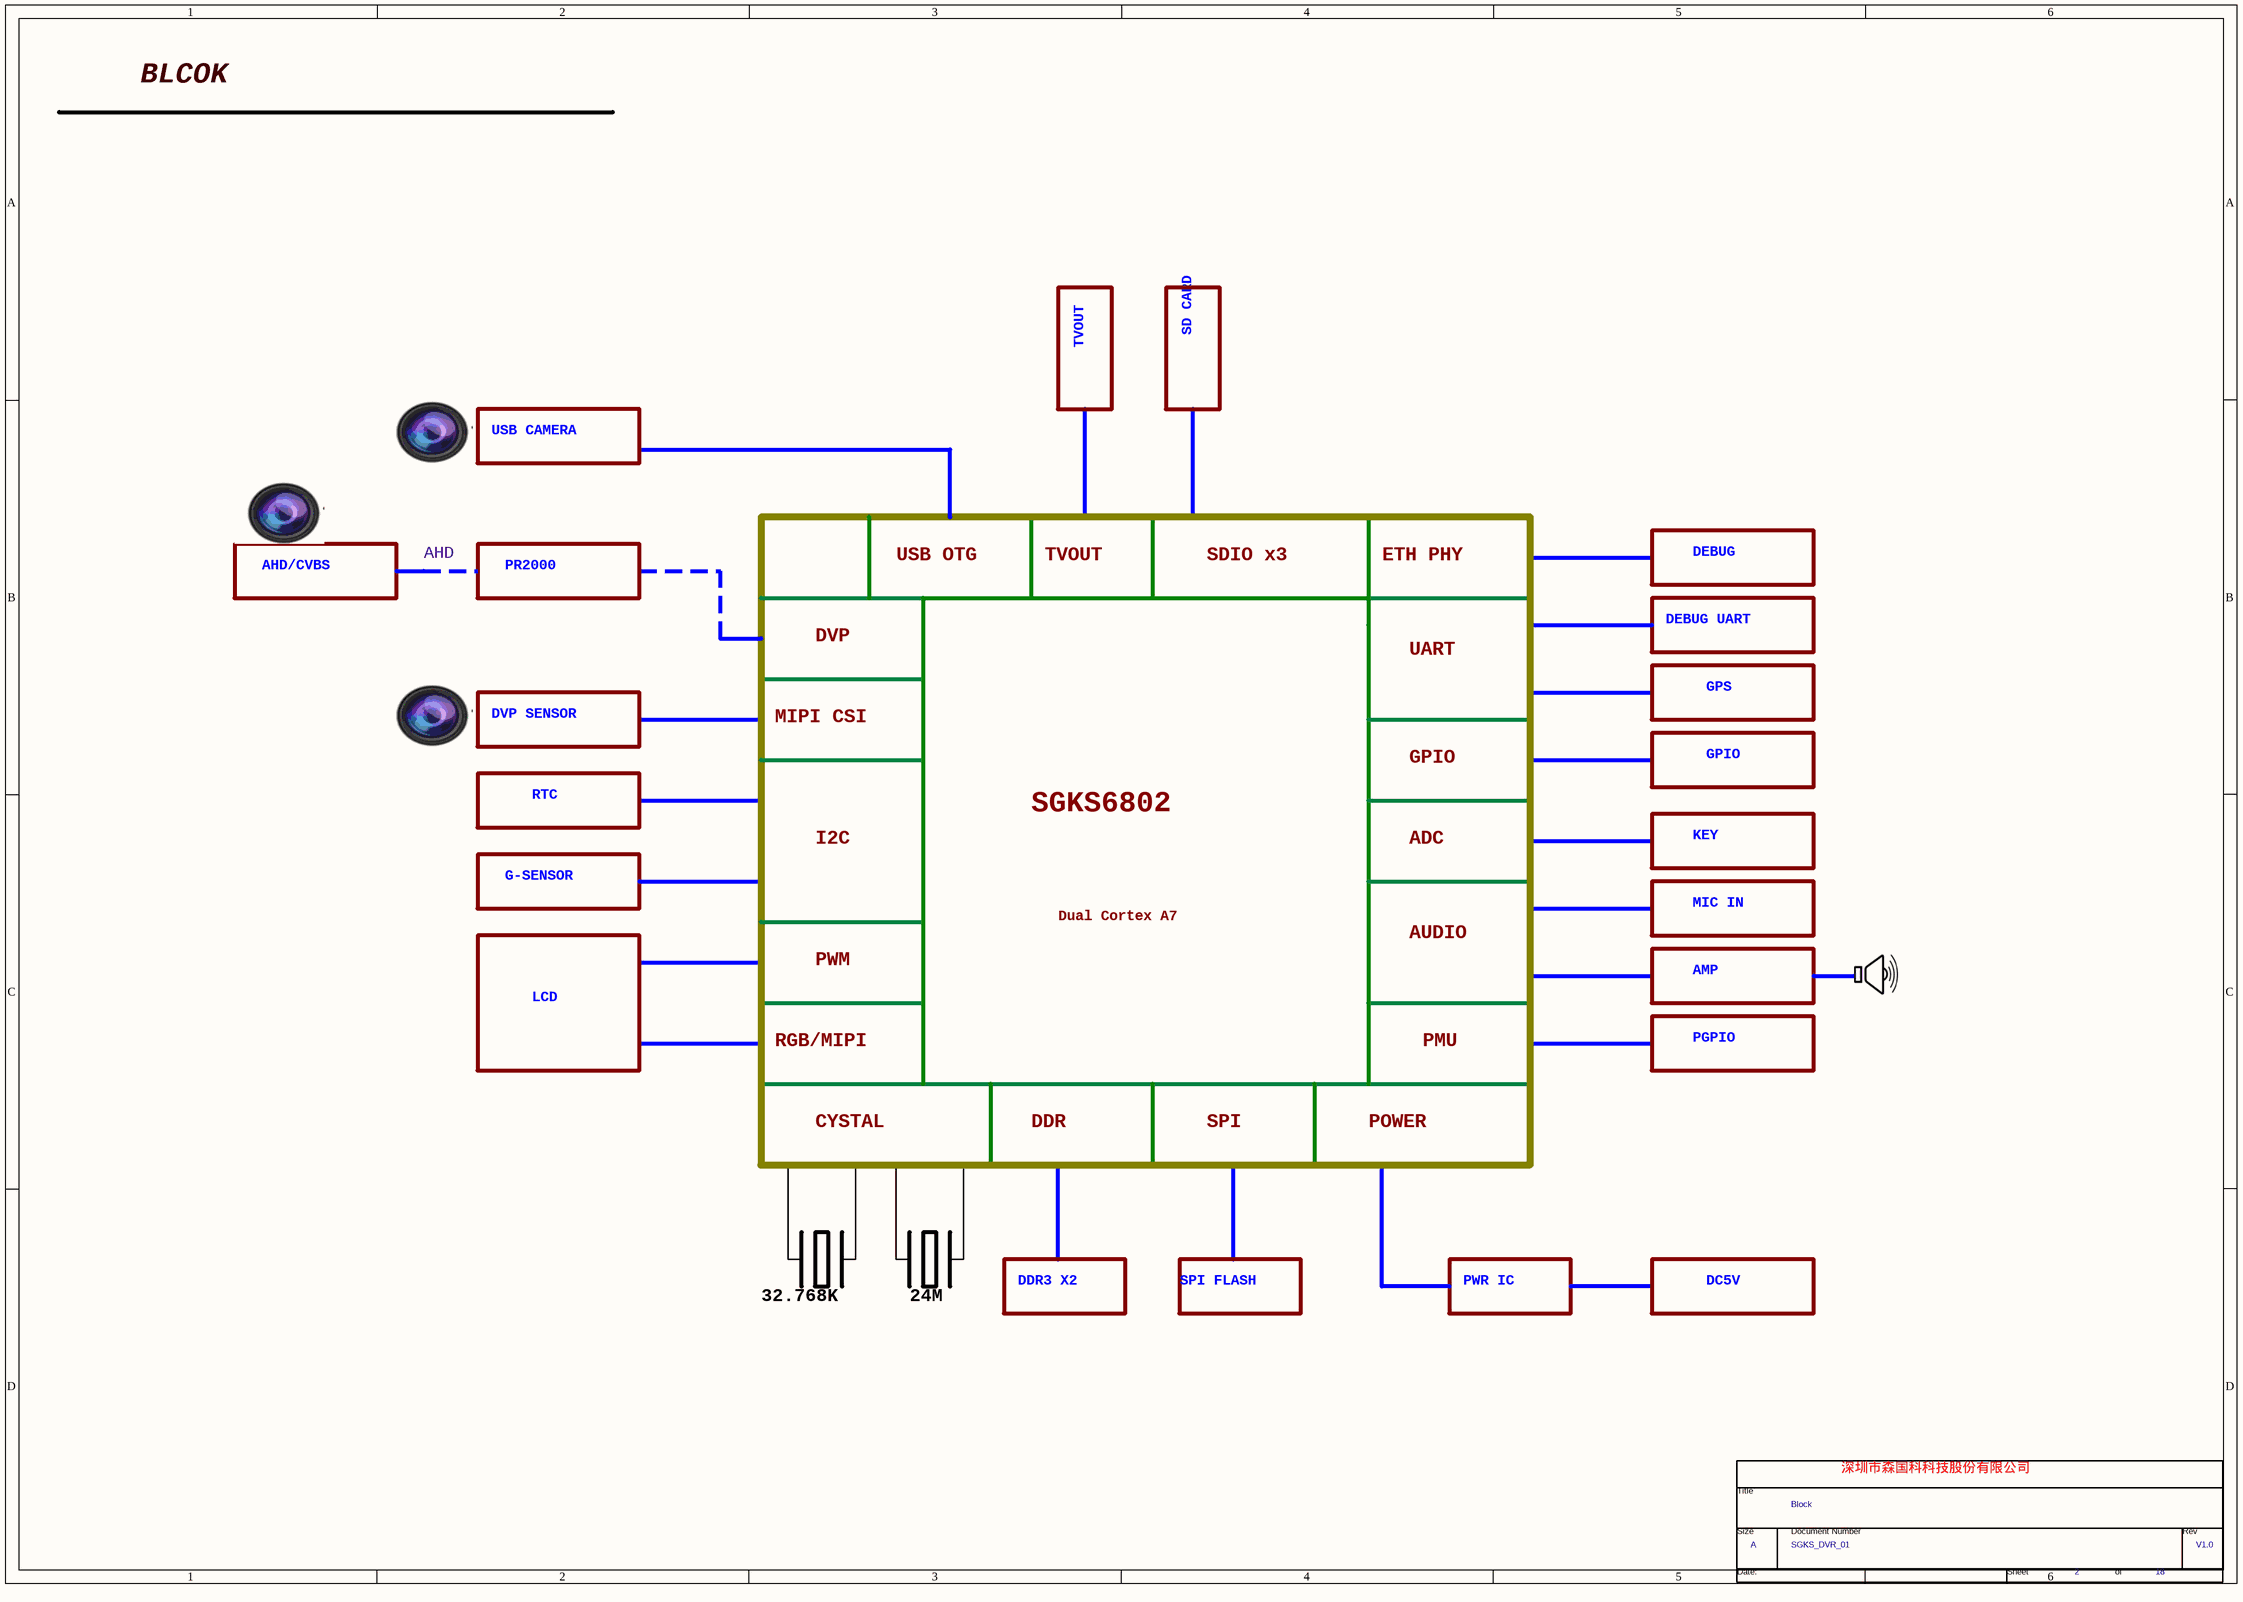
[diagram p15: P02 Block.SchDoc]

### Parts
(Parts that share a designator on the sheet are numbered #1, #2 ... from top to bottom, then left to right.)
*#16  Page Count: 18  Page Number: 2  Page Size: A  Title: Block  RevCode: V1.0  Doc: SGKS_DVR_01  (hidden comment: TitleBlock0)  (graphical)

### Notes on the sheet
- BLCOK
- TVOUT
- SD CARD
- USB CAMERA
- AHD/CVBS
- AHD
- PR2000
- USB OTG
- SDIO x3
- ETH PHY
- DEBUG
- DVP
- UART
- DEBUG UART
- DVP SENSOR
- MIPI CSI
- GPS
- RTC
- GPIO
- I2C
- SGKS6802
- ADC
- KEY
- G-SENSOR
- Dual Cortex A7
- MIC IN
- LCD
- PWM
- AUDIO
- AMP
- RGB/MIPI
- PMU
- PGPIO
- CYSTAL
- DDR
- SPI
- POWER
- 32.768K
- 24M
- DDR3 X2
- SPI FLASH
- PWR IC
- DC5V
- 深圳市森国科科技股份有限公司
- (in symbol TitleBlock0) Title; Size; Document Number; Rev; Date:; Sheet; of

### Library data of the parts
*#16 = TitleBlock0: Page Create Date: March  8, 1995

## Sheet P01 Version.SchDoc
size 297 x 209 mm
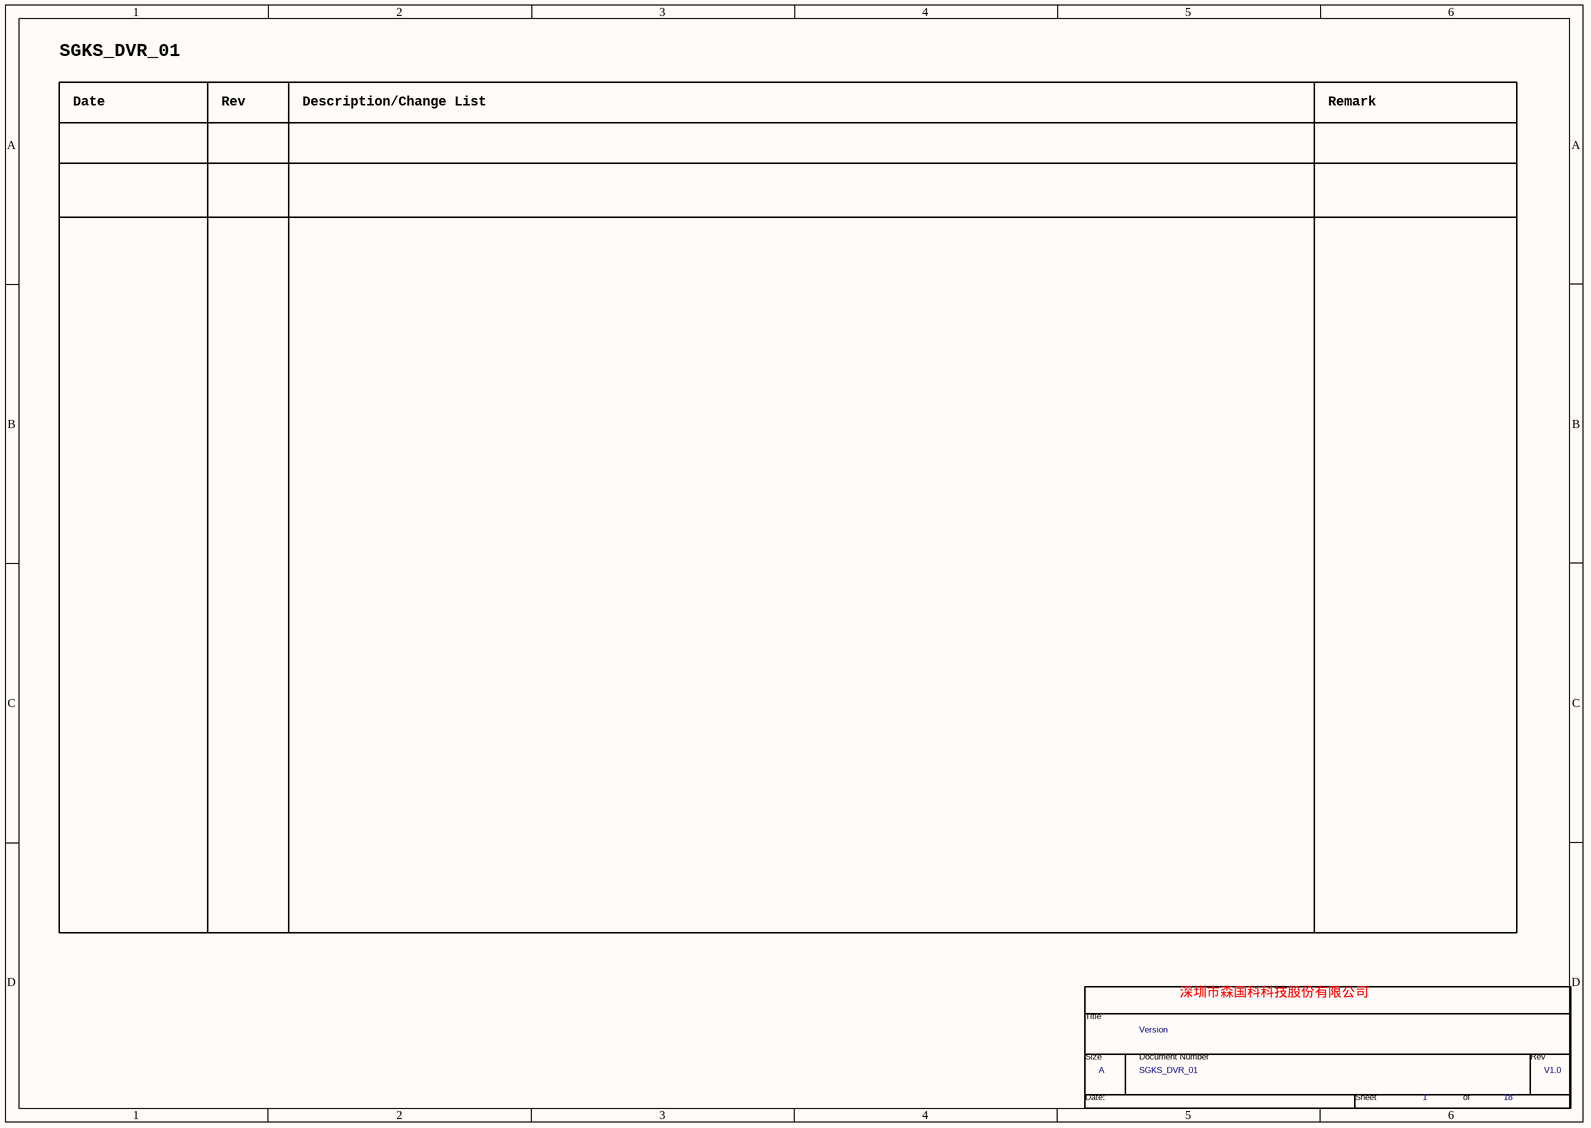
[diagram p16: P01 Version.SchDoc]

### Parts
(Parts that share a designator on the sheet are numbered #1, #2 ... from top to bottom, then left to right.)
*#17  Page Count: 18  Page Number: 1  Page Size: A  Title: Version  RevCode: V1.0  Doc: SGKS_DVR_01  (hidden comment: TitleBlock0)  (graphical)

### Notes on the sheet
- SGKS_DVR_01
- Date
- Rev
- Description/Change List
- Remark
- 深圳市森国科科技股份有限公司
- (in symbol TitleBlock0) Title; Size; Document Number; Rev; Date:; Sheet; of

### Library data of the parts
*#17 = TitleBlock0: Page Create Date: March  8, 1995

## Sheet P18 GPS.SchDoc
size 246 x 182 mm
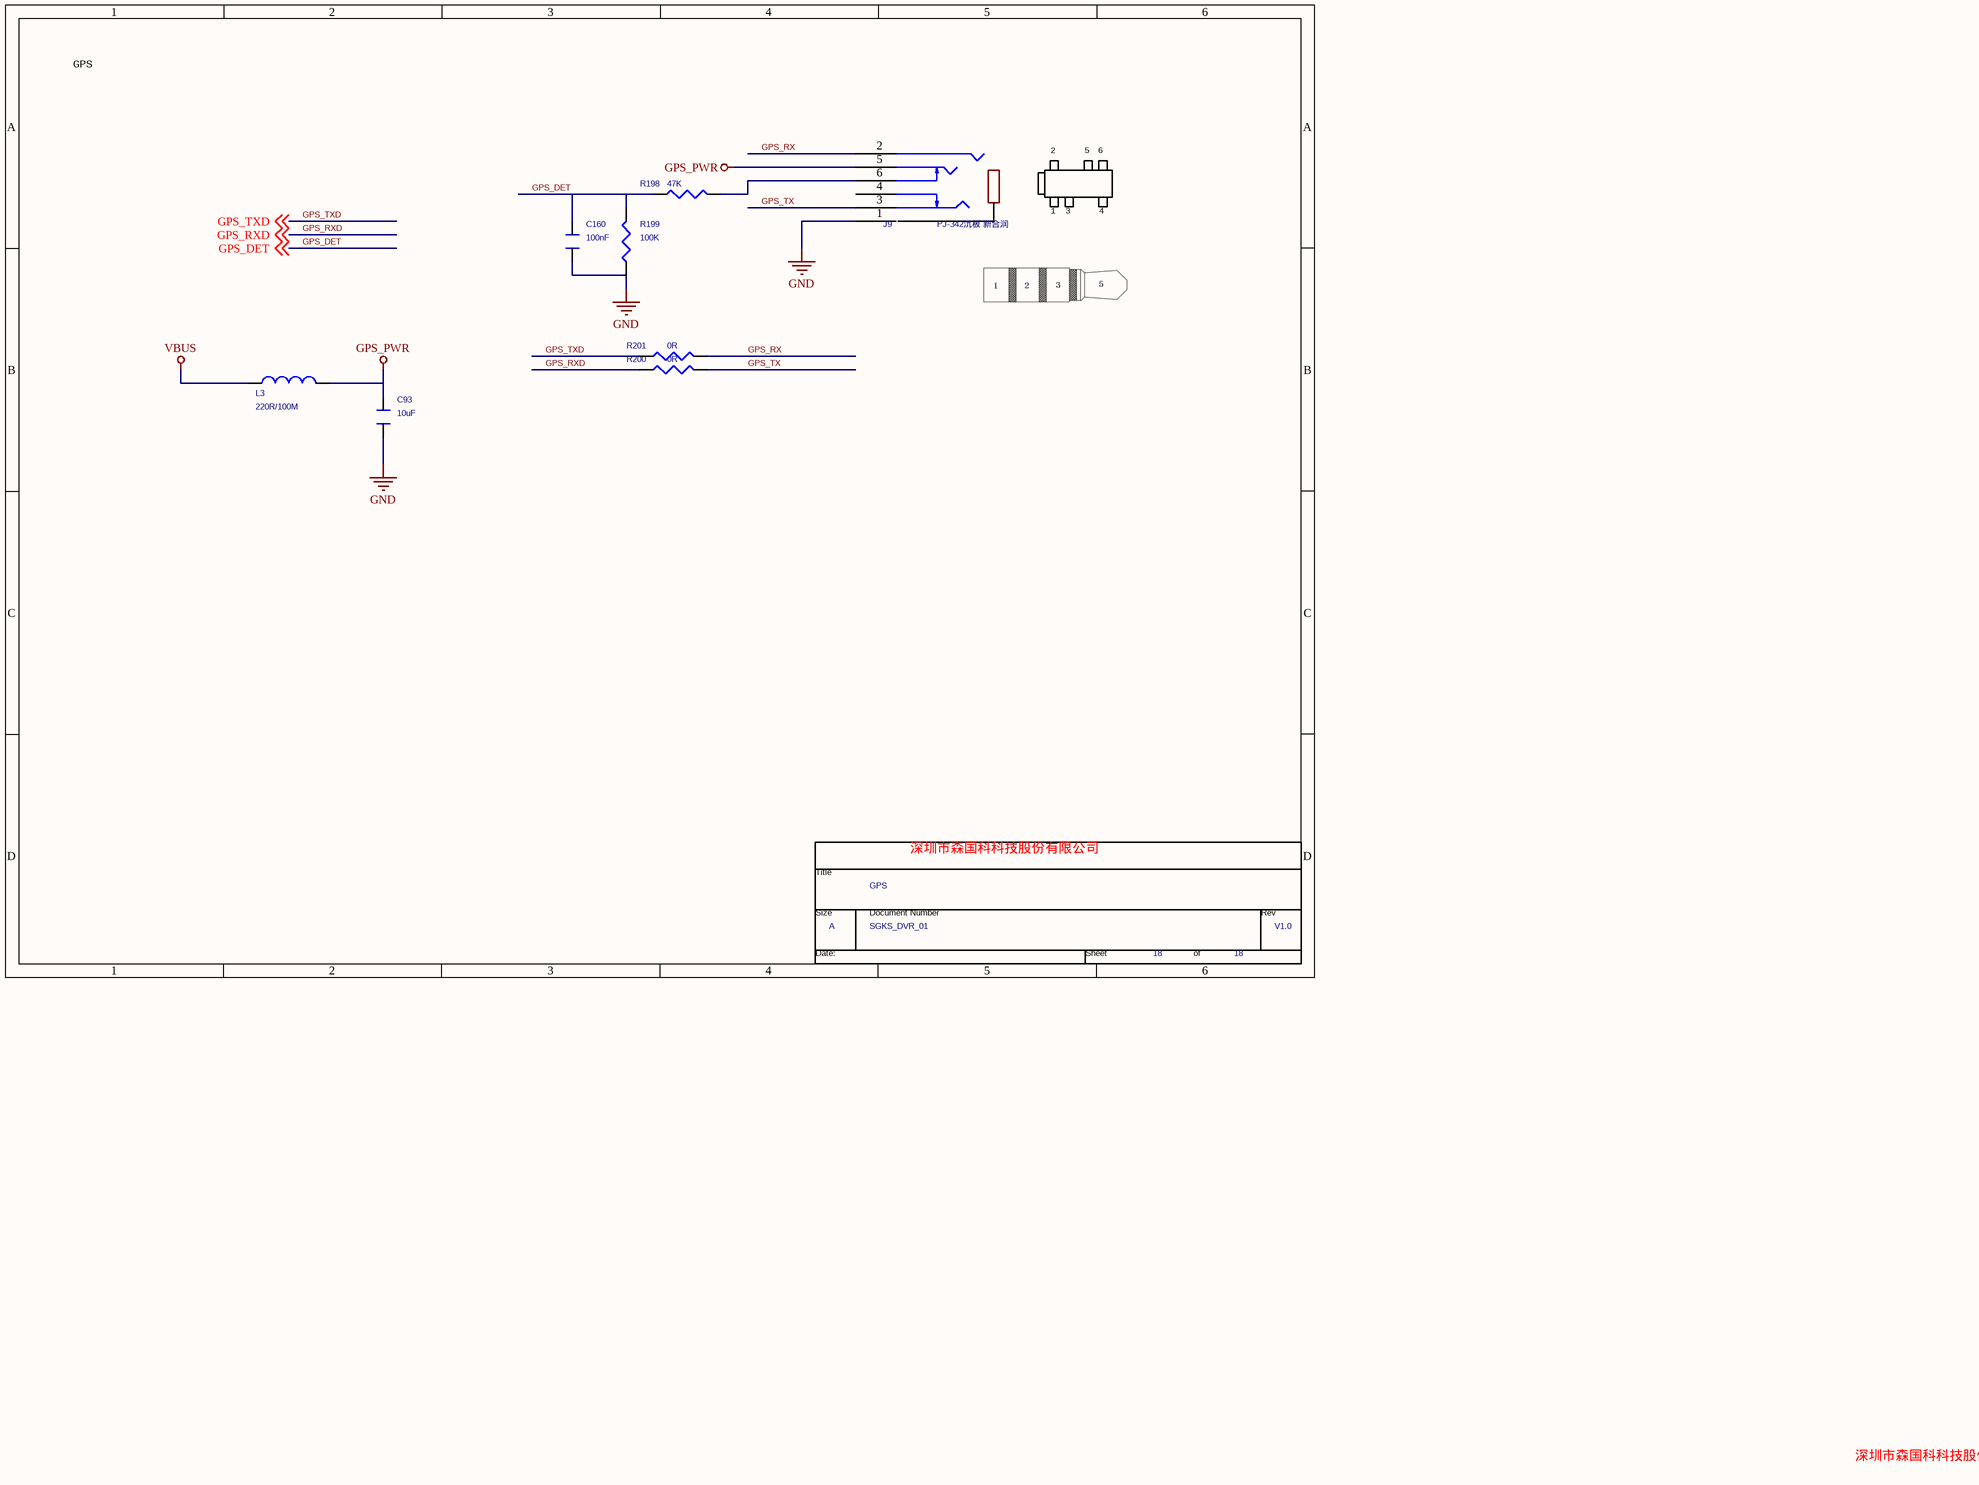
[diagram p17: P18 GPS.SchDoc]

### Parts
(Parts that share a designator on the sheet are numbered #1, #2 ... from top to bottom, then left to right.)
*#18  Page Count: 18  Page Size: A  Title: GPS  RevCode: V1.0  Doc: SGKS_DVR_01  (hidden comment: TitleBlock0)  (graphical)
C93  10uF  [C0603]
C160  100nF  [C0402]
J9  PJ-342沉板 新合润  [TSH-3865D]
L3  220R/100M  [L0402]
R198  47K  [R0603/SMD]
R199  100K  [R0603/SMD]
R200  0R  [R0603/SMD]
R201  0R  [R0603/SMD]

### Nets
GND: C93.1 C160.1 J9.1 R199.1
GPS_PWR: C93.2 J9.5 L3.1
VBUS: L3.2
GPS_DET: C160.2 R198.1 R199.2 ; off-sheet GPS_DET
GPS_RX: J9.2 R201.2
GPS_RXD: R200.1 ; off-sheet GPS_RXD
GPS_TX: J9.3 R200.2
GPS_TXD: R201.1 ; off-sheet GPS_TXD
NetJ9_6: J9.6 R198.2

Not connected (* = marked no-connect by the designer): J9 4

### Notes on the sheet
- GPS
- 2
- 5
- 6
- 1
- 3
- 4
- 深圳市森国科科技股份有限公司
- (in symbol TitleBlock0) Title; Size; Document Number; Rev; Date:; Sheet; of

### Library data of the parts
C93 C160 = CAPACITOR: PAGE: 1
J9 = PHONOJACK_2
L3 = INDUCTOR_2
R198-R201 = RES/SMD_1: Part Description: Chip Resistor; Type: 贴片电阻
*#18 = TitleBlock0: Page Number: 18; Page Create Date: March  8, 1995

## Nets that join several sheets
AVDD33: P17 POWER2 (R85.1), P16 POWER1 (9 pins), P15 AHD & USBCAM (R86.1 R113.2 R157.2), P14 FLASH & TF & GSENSO (6 pins), P13 MIC & AUDIO (FB4.1), P12 MIPI LCD (FB7.1), P11 CMOS SENSOR (6 pins), P10 PR2000K_MIPI (8 pins), P08 CPU_4 (7 pins), P07 CPU_3 (32 pins), P06 CPU_2 (5 pins)
AVDD_MIPIM: P16 POWER1 (C151.2 L7.1), P07 CPU_3 (7 pins)
DVDD_DDR: P16 POWER1 (7 pins), P10 PR2000K_MIPI (FB13.2), P07 CPU_3 (10 pins)
GND: P17 POWER2 (41 pins), P16 POWER1 (44 pins), P15 AHD & USBCAM (22 pins), P14 FLASH & TF & GSENSO (20 pins), P13 MIC & AUDIO (16 pins), P12 MIPI LCD (47 pins), P11 CMOS SENSOR (13 pins), P10 PR2000K_MIPI (31 pins), P09 DDR3 (80 pins), P08 CPU_4 (19 pins), P07 CPU_3 (290 pins), P06 CPU_2 (7 pins), P05 CPU_1 (R1.2 R2.2), P18 GPS (C93.1 C160.1 J9.1 R199.1)
PADA_VCOM: P08 CPU_4 (R178.2), P06 CPU_2 (U1.D13)
USB_5V: P17 POWER2 (12 pins), P16 POWER1 (D13.2 Q9.2 R190.1 R191.1)
VBUS: P17 POWER2 (8 pins), P16 POWER1 (15 pins), P15 AHD & USBCAM (C133.2 C135.2 Q4.2 R111.2), P13 MIC & AUDIO (FB8.2), P12 MIPI LCD (7 pins), P11 CMOS SENSOR (R37.1), P18 GPS (L3.2)
VCC_RTC: P17 POWER2 (KEY5.1), P16 POWER1 (C145.2 U16.2), P14 FLASH & TF & GSENSO (C115.1 FB11.1 U10.8)
VDD11: P16 POWER1 (8 pins), P08 CPU_4 (C57.2), P07 CPU_3 (28 pins), P06 CPU_2 (U1.W19)
VDD15: P16 POWER1 (6 pins), P09 DDR3 (65 pins), P08 CPU_4 (C40.1 C58.2 R10.2), P07 CPU_3 (16 pins), P06 CPU_2 (U1.Y21)
VDDIO_SR: P11 CMOS SENSOR (C64.2 C65.2 FB1.2 U4.5), P08 CPU_4 (R6.2 R7.2), P07 CPU_3 (U1.N5 U1.P5)
VREF_CPU: P08 CPU_4 (5 pins), P07 CPU_3 (U1.AB22)
A0: P09 DDR3 (U13.N3 U30.N3), P05 CPU_1 (U1.AC13)
A1: P09 DDR3 (U13.P7 U30.P7), P05 CPU_1 (U1.AE16)
A2: P09 DDR3 (U13.P3 U30.P3), P05 CPU_1 (U1.AE10)
A3: P09 DDR3 (U13.N2 U30.N2), P05 CPU_1 (U1.AC10)
A4: P09 DDR3 (U13.P8 U30.P8), P05 CPU_1 (U1.AD16)
A5: P09 DDR3 (U13.P2 U30.P2), P05 CPU_1 (U1.AD10)
A6: P09 DDR3 (U13.R8 U30.R8), P05 CPU_1 (U1.AE18)
A7: P09 DDR3 (U13.R2 U30.R2), P05 CPU_1 (U1.AC11)
A8: P09 DDR3 (U13.T8 U30.T8), P05 CPU_1 (U1.AC15)
A9: P09 DDR3 (U13.R3 U30.R3), P05 CPU_1 (U1.AE9)
A10: P09 DDR3 (U13.L7 U30.L7), P05 CPU_1 (U1.AC14)
A11: P09 DDR3 (U13.R7 U30.R7), P05 CPU_1 (U1.AE17)
A12: P09 DDR3 (U13.N7 U30.N7), P05 CPU_1 (U1.AD15)
A13: P09 DDR3 (U13.T3 U30.T3), P05 CPU_1 (U1.AB10)
A14: P09 DDR3 (U13.T7 U30.T7), P05 CPU_1 (U1.AD17)
A15: P09 DDR3 (U13.M7 U30.M7), P05 CPU_1 (U1.AD11)
ACC_DET: P17 POWER2 (R174.1 R184.2), P06 CPU_2 (U1.AD1)
ACC_EN: P17 POWER2 (Q6.2 R184.1), P16 POWER1 (D12.2 Q7.2 R176.1 R177.1)
ADC_BAT: P17 POWER2 (C182.2 R159.2 R166.1), P06 CPU_2 (U1.C4)
ADC_KEY: P17 POWER2 (C122.2 R85.2 R167.2), P06 CPU_2 (U1.D5)
AHD_RESET: P10 PR2000K_MIPI (R32.2), P06 CPU_2 (U1.AA4)
AUDREF: P08 CPU_4 (C39.1), P06 CPU_2 (U1.P22)
BA0: P09 DDR3 (U13.M2 U30.M2), P05 CPU_1 (U1.AE11)
BA1: P09 DDR3 (U13.N8 U30.N8), P05 CPU_1 (U1.AE15)
BA2: P09 DDR3 (U13.M3 U30.M3), P05 CPU_1 (U1.AB13)
BC_DET: P15 AHD & USBCAM (R181.2), P06 CPU_2 (U1.AA23)
BC_INDET: P15 AHD & USBCAM (R87.1 R88.2), P06 CPU_2 (U1.Y23)
BC_PWREN: P15 AHD & USBCAM (R99.1 U15.4), P06 CPU_2 (U1.AB1)
CAS#: P09 DDR3 (U13.K3 U30.K3), P05 CPU_1 (U1.AE14)
CKE: P09 DDR3 (U13.K9 U30.K9), P05 CPU_1 (U1.AA17)
CLK: P09 DDR3 (R56.1), P05 CPU_1 (U1.AD13)
CLK#: P09 DDR3 (R57.1), P05 CPU_1 (U1.AE13)
DM0: P09 DDR3 (U30.E7), P05 CPU_1 (U1.AB21)
DM1: P09 DDR3 (U30.D3), P05 CPU_1 (U1.AD18)
DM2: P09 DDR3 (U13.E7), P05 CPU_1 (U1.AE7)
DM3: P09 DDR3 (U13.D3), P05 CPU_1 (U1.AC4)
DQ0: P09 DDR3 (U30.E3), P05 CPU_1 (U1.AB18)
DQ1: P09 DDR3 (U30.F7), P05 CPU_1 (U1.AC21)
DQ2: P09 DDR3 (U30.F2), P05 CPU_1 (U1.AC17)
DQ3: P09 DDR3 (U30.F8), P05 CPU_1 (U1.AC22)
DQ4: P09 DDR3 (U30.H3), P05 CPU_1 (U1.AB20)
DQ5: P09 DDR3 (U30.H8), P05 CPU_1 (U1.AB23)
DQ6: P09 DDR3 (U30.G2), P05 CPU_1 (U1.AB17)
DQ7: P09 DDR3 (U30.H7), P05 CPU_1 (U1.AC24)
DQ8: P09 DDR3 (U30.D7), P05 CPU_1 (U1.AE22)
DQ9: P09 DDR3 (U30.C3), P05 CPU_1 (U1.AE21)
DQ10: P09 DDR3 (U30.C8), P05 CPU_1 (U1.AD25)
DQ11: P09 DDR3 (U30.C2), P05 CPU_1 (U1.AD19)
DQ12: P09 DDR3 (U30.A7), P05 CPU_1 (U1.AE24)
DQ13: P09 DDR3 (U30.A2), P05 CPU_1 (U1.AE20)
DQ14: P09 DDR3 (U30.B8), P05 CPU_1 (U1.AD24)
DQ15: P09 DDR3 (U30.A3), P05 CPU_1 (U1.AD20)
DQ16: P09 DDR3 (U13.E3), P05 CPU_1 (U1.AD4)
DQ17: P09 DDR3 (U13.F7), P05 CPU_1 (U1.AD7)
DQ18: P09 DDR3 (U13.F2), P05 CPU_1 (U1.AE3)
DQ19: P09 DDR3 (U13.F8), P05 CPU_1 (U1.AD8)
DQ20: P09 DDR3 (U13.H3), P05 CPU_1 (U1.AE2)
DQ21: P09 DDR3 (U13.H8), P05 CPU_1 (U1.AE8)
DQ22: P09 DDR3 (U13.G2), P05 CPU_1 (U1.AD3)
DQ23: P09 DDR3 (U13.H7), P05 CPU_1 (U1.AE6)
DQ24: P09 DDR3 (U13.D7), P05 CPU_1 (U1.AC5)
DQ25: P09 DDR3 (U13.C3), P05 CPU_1 (U1.AB5)
DQ26: P09 DDR3 (U13.C8), P05 CPU_1 (U1.AC9)
DQ27: P09 DDR3 (U13.C2), P05 CPU_1 (U1.AC2)
DQ28: P09 DDR3 (U13.A7), P05 CPU_1 (U1.AC6)
DQ29: P09 DDR3 (U13.A2), P05 CPU_1 (U1.AC3)
DQ30: P09 DDR3 (U13.B8), P05 CPU_1 (U1.AC8)
DQ31: P09 DDR3 (U13.A3), P05 CPU_1 (U1.AB4)
DQS0: P09 DDR3 (U30.F3), P05 CPU_1 (U1.AC19)
DQS0#: P09 DDR3 (U30.G3), P05 CPU_1 (U1.AC20)
DQS1: P09 DDR3 (U30.C7), P05 CPU_1 (U1.AE23)
DQS1#: P09 DDR3 (U30.B7), P05 CPU_1 (U1.AD23)
DQS2: P09 DDR3 (U13.F3), P05 CPU_1 (U1.AD5)
DQS2#: P09 DDR3 (U13.G3), P05 CPU_1 (U1.AE5)
DQS3: P09 DDR3 (U13.C7), P05 CPU_1 (U1.AB7)
DQS3#: P09 DDR3 (U13.B7), P05 CPU_1 (U1.AB6)
G_SEN_SCK: P14 FLASH & TF & GSENSO (U10.6 U11.12), P10 PR2000K_MIPI (R33.2), P08 CPU_4 (R8.1), P06 CPU_2 (U1.W5)
G_SEN_SDA: P14 FLASH & TF & GSENSO (U10.5 U11.2), P10 PR2000K_MIPI (R34.2), P08 CPU_4 (R9.1), P06 CPU_2 (U1.Y5)
GPS_DET: P06 CPU_2 (U1.W4), P18 GPS (C160.2 R198.1 R199.2)
GPS_RXD: P06 CPU_2 (U1.D18), P18 GPS (R200.1)
GPS_TXD: P06 CPU_2 (U1.C19), P18 GPS (R201.1)
GS_WAKEUP: P16 POWER1 (D11.1), P14 FLASH & TF & GSENSO (U11.6)
IDAC_OUT: P08 CPU_4 (C74.1 R95.2), P06 CPU_2 (U1.C8)
JTAG_TCK: P08 CPU_4 (TP25.1), P06 CPU_2 (U1.D16)
JTAG_TDI: P08 CPU_4 (TP13.1), P06 CPU_2 (U1.C15)
JTAG_TDO: P08 CPU_4 (TP23.1), P06 CPU_2 (U1.C16)
JTAG_TMS: P08 CPU_4 (TP22.1), P06 CPU_2 (U1.D15)
JTAG_TRSTN: P08 CPU_4 (TP24.1), P06 CPU_2 (U1.C17)
LCD_BL_EN: P12 MIPI LCD (R49.1), P05 CPU_1 (U1.J3)
LCD_DEN: P12 MIPI LCD (R29.1 U7.3), P05 CPU_1 (U1.H1)
LCD_RST: P12 MIPI LCD (R194.2), P05 CPU_1 (U1.H3)
LED_KEY: P17 POWER2 (R153.1), P06 CPU_2 (U1.Y1)
LED_REC: P17 POWER2 (R152.1), P06 CPU_2 (U1.W3)
MICBIAS: P13 MIC & AUDIO (R60.1), P06 CPU_2 (U1.N24)
MICINN: P13 MIC & AUDIO (C131.2 R169.2), P06 CPU_2 (U1.M24)
MICINP: P13 MIC & AUDIO (C127.2 R130.2), P06 CPU_2 (U1.M25)
MIPI_DSI_CLKN: P12 MIPI LCD (R135.2), P05 CPU_1 (U1.B12)
MIPI_DSI_CLKP: P12 MIPI LCD (R136.2), P05 CPU_1 (U1.A12)
MIPI_DSI_DN0: P12 MIPI LCD (R128.2), P05 CPU_1 (U1.B14)
MIPI_DSI_DN1: P12 MIPI LCD (R192.2), P05 CPU_1 (U1.B13)
MIPI_DSI_DP0: P12 MIPI LCD (R134.2), P05 CPU_1 (U1.A14)
MIPI_DSI_DP1: P12 MIPI LCD (R193.2), P05 CPU_1 (U1.A13)
ODT: P09 DDR3 (U13.K1 U30.K1), P05 CPU_1 (U1.AB11)
PA_SHDN: P13 MIC & AUDIO (R63.1 U9.1), P06 CPU_2 (U1.AA1)
PMU_RSTN: P08 CPU_4 (C44.2 R13.2), P06 CPU_2 (U1.AB25)
PMU_XIN: P08 CPU_4 (C35.1 R5.1 Y1.1), P06 CPU_2 (U1.V25)
PMU_XOUT: P08 CPU_4 (C36.1 Y1.3), P06 CPU_2 (U1.V24)
POWER_HOLD: P16 POWER1 (R163.2), P06 CPU_2 (U1.Y22)
PWR_KEY: P16 POWER1 (R140.1 R143.1), P06 CPU_2 (U1.Y24)
PWR_ON: P17 POWER2 (KEY5.2), P16 POWER1 (R139.2)
RAS#: P09 DDR3 (U13.J3 U30.J3), P05 CPU_1 (U1.AC12)
RESET#: P09 DDR3 (U13.T2 U30.T2), P05 CPU_1 (U1.AC25)
RESET_KEY: P17 POWER2 (KEY4.1), P08 CPU_4 (R11.2 R13.1 U2.2)
SD1_CD: P14 FLASH & TF & GSENSO (R78.2), P06 CPU_2 (U1.F24)
SD1_CLK: P14 FLASH & TF & GSENSO (R80.2), P06 CPU_2 (U1.D25)
SD1_CMD: P14 FLASH & TF & GSENSO (R72.2), P06 CPU_2 (U1.D24)
SD1_DAT0: P14 FLASH & TF & GSENSO (R71.2), P06 CPU_2 (U1.E24)
SD1_DAT1: P14 FLASH & TF & GSENSO (R70.2), P06 CPU_2 (U1.E25)
SD1_DAT2: P14 FLASH & TF & GSENSO (R69.2), P06 CPU_2 (U1.C24)
SD1_DAT3: P14 FLASH & TF & GSENSO (R68.2), P06 CPU_2 (U1.C25)
SENSOR0_MIPI_CLKM: P10 PR2000K_MIPI (U23.32), P05 CPU_1 (U1.U2)
SENSOR0_MIPI_CLKP: P10 PR2000K_MIPI (U23.31), P05 CPU_1 (U1.U1)
SENSOR0_MIPI_DM0: P10 PR2000K_MIPI (U23.30), P05 CPU_1 (U1.W2)
SENSOR0_MIPI_DM1: P10 PR2000K_MIPI (U23.27), P05 CPU_1 (U1.V1)
SENSOR0_MIPI_DM2: P10 PR2000K_MIPI (U23.24), P05 CPU_1 (U1.T1)
SENSOR0_MIPI_DM3: P10 PR2000K_MIPI (U23.22), P05 CPU_1 (U1.R1)
SENSOR0_MIPI_DP0: P10 PR2000K_MIPI (U23.29), P05 CPU_1 (U1.W1)
SENSOR0_MIPI_DP1: P10 PR2000K_MIPI (U23.26), P05 CPU_1 (U1.V2)
SENSOR0_MIPI_DP2: P10 PR2000K_MIPI (U23.23), P05 CPU_1 (U1.T2)
SENSOR0_MIPI_DP3: P10 PR2000K_MIPI (U23.21), P05 CPU_1 (U1.R2)
SENSOR_D0: P11 CMOS SENSOR (RN6.1), P05 CPU_1 (U1.P4)
SENSOR_D1: P11 CMOS SENSOR (RN6.2), P05 CPU_1 (U1.P3)
SENSOR_D2: P11 CMOS SENSOR (RN6.3), P05 CPU_1 (U1.P2)
SENSOR_D3: P11 CMOS SENSOR (RN6.4), P05 CPU_1 (U1.P1)
SENSOR_D4: P11 CMOS SENSOR (RN4.1), P05 CPU_1 (U1.N3)
SENSOR_D5: P11 CMOS SENSOR (RN4.2), P05 CPU_1 (U1.N1)
SENSOR_D6: P11 CMOS SENSOR (RN4.3), P05 CPU_1 (U1.N2)
SENSOR_D7: P11 CMOS SENSOR (RN4.4), P05 CPU_1 (U1.M1)
SENSOR_D8: P11 CMOS SENSOR (RN5.1), P05 CPU_1 (U1.M2)
SENSOR_D9: P11 CMOS SENSOR (RN5.2), P05 CPU_1 (U1.L1)
SENSOR_D10: P11 CMOS SENSOR (RN5.3), P05 CPU_1 (U1.L2)
SENSOR_D11: P11 CMOS SENSOR (RN5.4), P05 CPU_1 (U1.K1)
SENSOR_HSYNC: P11 CMOS SENSOR (FPC1.14), P05 CPU_1 (U1.R3)
SENSOR_MCLK: P11 CMOS SENSOR (R24.1), P05 CPU_1 (U1.J1)
SENSOR_PWREN: P11 CMOS SENSOR (R35.2), P05 CPU_1 (U1.L4)
SENSOR_RESET: P11 CMOS SENSOR (R36.2), P05 CPU_1 (U1.L3)
SENSOR_SCL: P11 CMOS SENSOR (FPC1.5), P08 CPU_4 (R6.1), P05 CPU_1 (U1.M3)
SENSOR_SDA: P11 CMOS SENSOR (FPC1.4), P08 CPU_4 (R7.1), P05 CPU_1 (U1.M4)
SENSOR_SPCLK: P11 CMOS SENSOR (R31.2), P05 CPU_1 (U1.J2)
SENSOR_VSYNC: P11 CMOS SENSOR (FPC1.13), P05 CPU_1 (U1.R4)
SFL_CLK: P14 FLASH & TF & GSENSO (U12.6), P06 CPU_2 (U1.A19)
SFL_CS: P14 FLASH & TF & GSENSO (R82.2 U12.1), P06 CPU_2 (U1.A18)
SFL_HOLD: P14 FLASH & TF & GSENSO (R83.2 U12.7), P06 CPU_2 (U1.B18)
SFL_MISO: P14 FLASH & TF & GSENSO (U12.2), P06 CPU_2 (U1.B17)
SFL_MOSI: P14 FLASH & TF & GSENSO (U12.5), P06 CPU_2 (U1.B19)
SFL_WP: P14 FLASH & TF & GSENSO (R84.2 U12.3), P06 CPU_2 (U1.A17)
USB_DETA: P17 POWER2 (R162.1), P06 CPU_2 (U1.Y25)
USB_DM: P15 AHD & USBCAM (R106.2), P06 CPU_2 (U1.G25)
USB_DP: P15 AHD & USBCAM (R107.2), P06 CPU_2 (U1.G24)
USB_OTG_ID: P15 AHD & USBCAM (R109.2 R118.2 R157.1), P06 CPU_2 (U1.D17)
V_CONTORL: P17 POWER2 (R164.1), P06 CPU_2 (U1.AB24)
VIN_AHD: P15 AHD & USBCAM (R89.2), P10 PR2000K_MIPI (C52.1)
VOML_LINE0: P13 MIC & AUDIO (C113.1), P06 CPU_2 (U1.T25)
VOPL_LINE0: P13 MIC & AUDIO (C112.1), P06 CPU_2 (U1.T24)
WE#: P09 DDR3 (U13.L3 U30.L3), P05 CPU_1 (U1.AD12)